# EAGLE design CANTensegrityBoard (EAGLE 6.4)

## Sheet 1 of 6
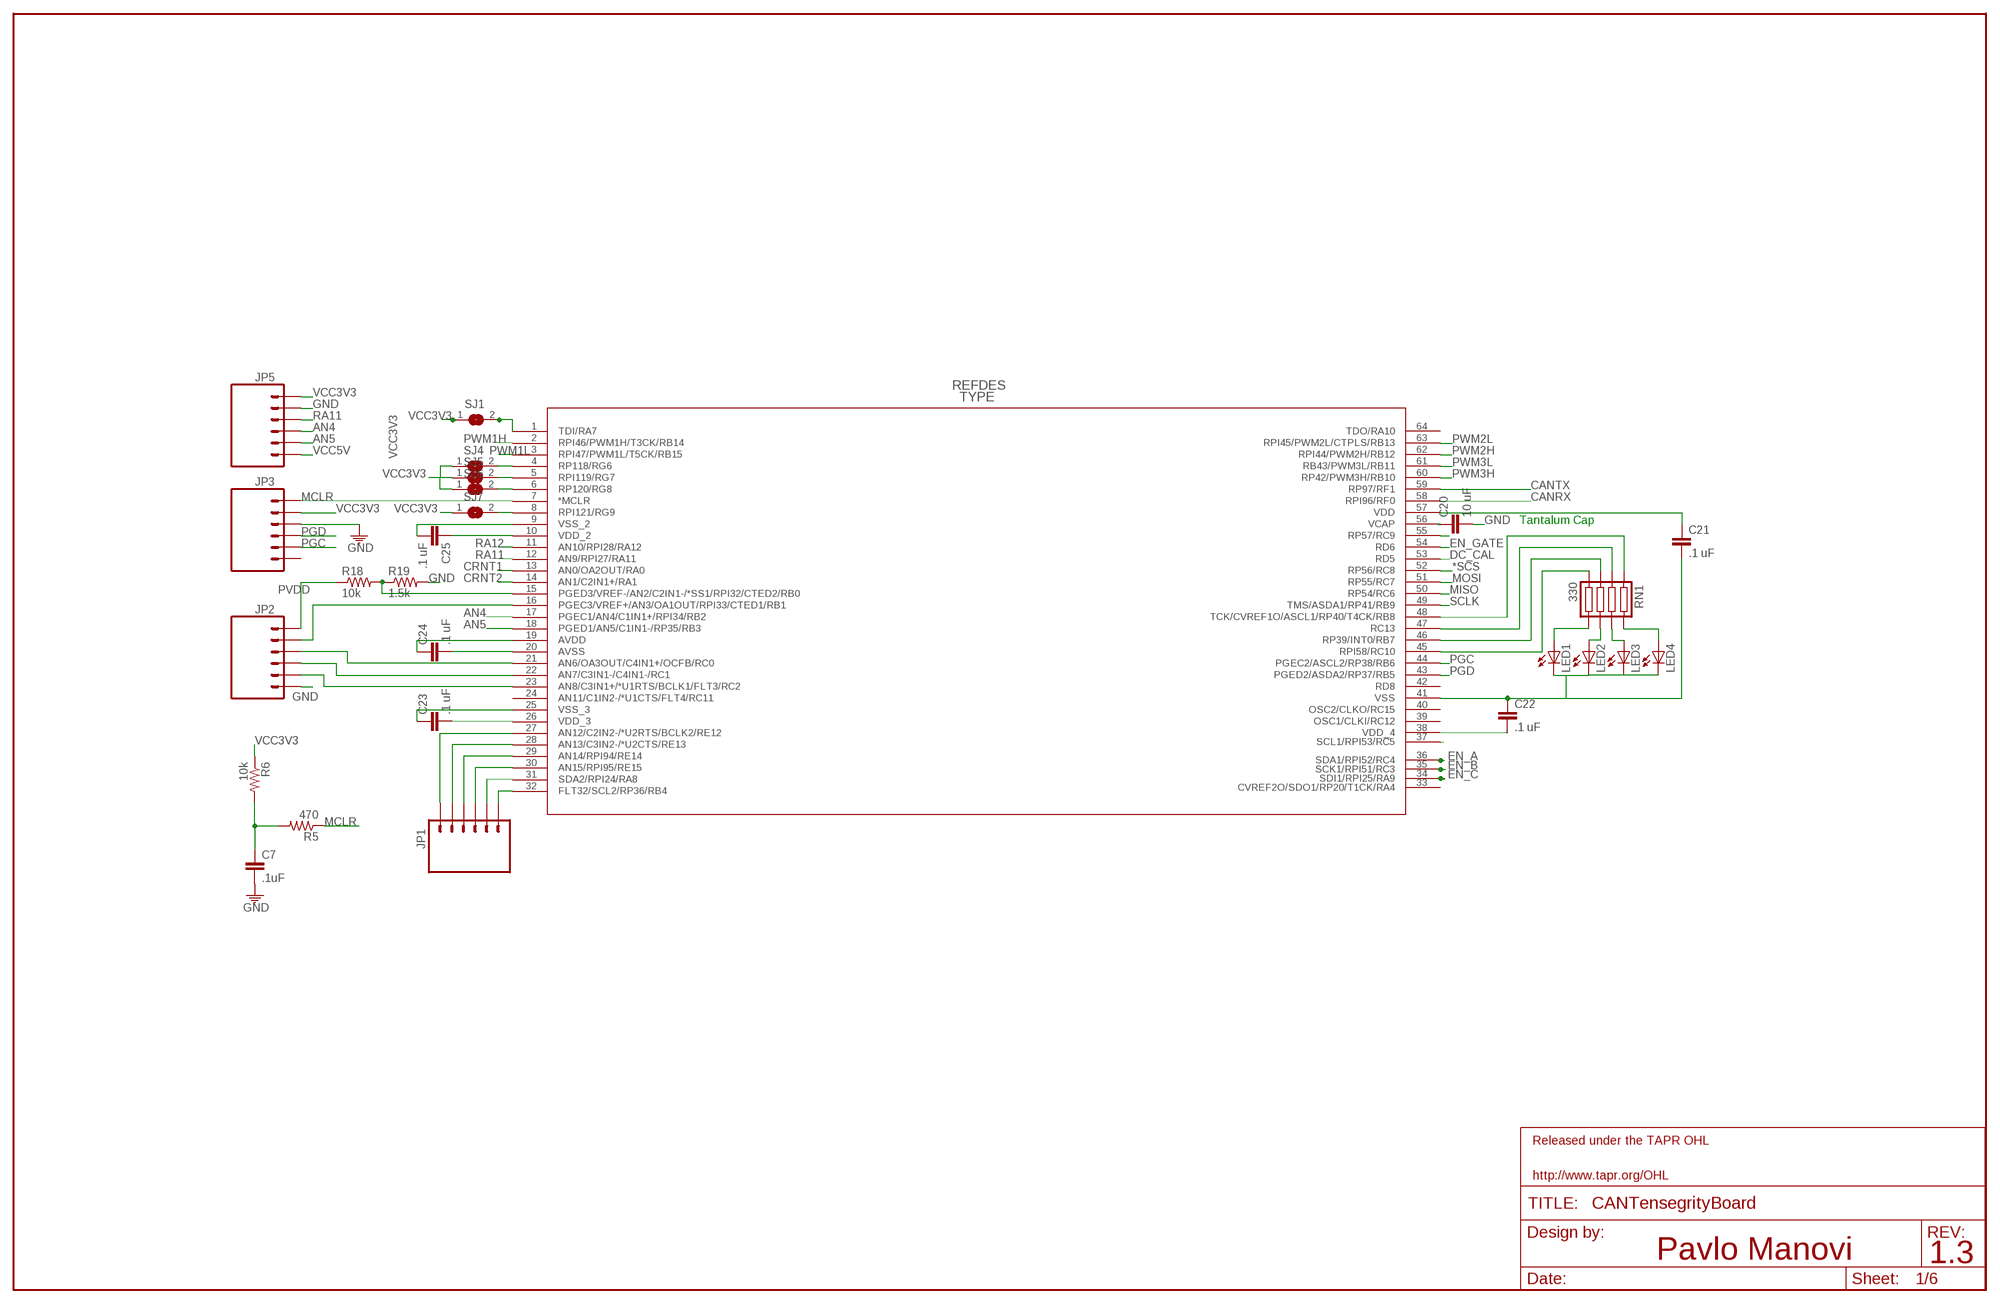
[diagram p0: schematic, sheet 1]

### Parts
C7  .1uF  CAP0805  [0805]
C20  10 uF  CAP1206  [1206]
C21  .1 uF  CAP0805  [0805]
C22  .1 uF  CAP0805  [0805]
C23  .1 uF  CAP0805  [0805]
C24  .1 uF  CAP0805  [0805]
C25  .1 uF  CAP0805  [0805]
JP1  M06SIP  [1X06]
JP2  M06SIP  [1X06]
JP3  M06LOCK  [1X06_LOCK]
JP5  M06LOCK  [1X06_LOCK]
LED1  LED0805  [LED-0805]
LED2  LED0805  [LED-0805]
LED3  LED0805  [LED-0805]
LED4  LED0805  [LED-0805]
R5  470  RESISTOR0805-RES  [0805]
R6  10k  RESISTOR0805-RES  [0805]
R18  10k  RESISTOR0805-RES  [0805]
R19  1.5k  RESISTOR0805-RES  [0805]
RN1  330  RESISTOR_ARRAY-4  [EXB-38V271JV]
SJ1  SJ  [SJ]
SJ4  SJ  [SJ]
SJ5  SJ  [SJ]
SJ6  SJ  [SJ]
SJ7  SJ  [SJ]
U$1  DSPIC33EP128MC502-I/SS  DSPIC33EP256MC50  [QFP64-10X10MC]

### Nets
*SCS [Power]: U$1.52(RP56/RC8) ; also sheet 2
AN4: JP5.4 U$1.17(PGEC1/AN4/C1IN1+/RPI34/RB2)
AN5: JP5.5 U$1.18(PGED1/AN5/C1IN1-/RP35/RB3)
CANRX: U$1.58(RPI96/RF0) ; also sheet 4
CANTX: U$1.59(RP97/RF1) ; also sheet 4
CRNT1: U$1.13(AN0/OA2OUT/RA0) ; also sheet 2
CRNT2: U$1.14(AN1/C2IN1+/RA1) ; also sheet 2
DC_CAL: U$1.53(RD5) ; also sheet 2
EN_A: U$1.36(SDA1/RPI52/RC4) ; also sheet 6
EN_B: U$1.35(SCK1/RPI51/RC3) ; also sheet 6
EN_C: U$1.34(SDI1/RPI25/RA9) ; also sheet 6
EN_GATE: U$1.54(RD6) ; also sheet 2
GND: C7.2 C20.2 C21.2 C22.1 C23.1 C24.2 C25.2 JP2.6 JP3.3 JP5.2 LED1.2(C) LED2.2(C) LED3.2(C) LED4.2(C) R19.2 U$1.9(VSS_2) U$1.20(AVSS) U$1.25(VSS_3) U$1.41(VSS) ; also sheet 3,4,5,6
MCLR: JP3.1 R5.1 U$1.7(*MCLR)
MISO: U$1.50(RP54/RC6) ; also sheet 2
MOSI: U$1.51(RP55/RC7) ; also sheet 2
N$2: C7.1 R5.2 R6.2
N$5: SJ1.2 U$1.1(TDI/RA7)
N$25: R18.2 R19.1 U$1.15(PGED3/VREF-/AN2/C2IN1-/*SS1/RPI32/CTED2/RB0)
N$26: U$1.37(SCL1/RPI53/RC5)
N$27: SJ4.2 U$1.4(RP118/RG6)
N$28: SJ5.2 U$1.5(RPI119/RG7)
N$29: SJ6.2 U$1.6(RP120/RG8)
N$30: SJ7.2 U$1.8(RPI121/RG9)
N$31: C20.1 U$1.56(VCAP)
N$33: RN1.P$1 U$1.48(TCK/CVREF1O/ASCL1/RP40/T4CK/RB8)
N$41: RN1.P$2 U$1.47(RC13)
N$42: RN1.P$3 U$1.46(RP39/INT0/RB7)
N$43: RN1.P$4 U$1.45(RPI58/RC10)
N$44: LED1.1(A) RN1.P$5
N$45: LED2.1(A) RN1.P$6
N$46: LED3.1(A) RN1.P$7
N$47: LED4.1(A) RN1.P$8
N$48: JP1.6 U$1.32(FLT32/SCL2/RP36/RB4)
N$49: JP1.5 U$1.31(SDA2/RPI24/RA8)
N$50: JP1.4 U$1.30(AN15/RPI95/RE15)
N$51: JP1.3 U$1.29(AN14/RPI94/RE14)
N$52: JP1.2 U$1.28(AN13/C3IN2-/*U2CTS/RE13)
N$53: JP1.1 U$1.27(AN12/C2IN2-/*U2RTS/BCLK2/RE12)
N$55: JP2.2 U$1.16(PGEC3/VREF+/AN3/OA1OUT/RPI33/CTED1/RB1)
N$56: JP2.3 U$1.21(AN6/OA3OUT/C4IN1+/OCFB/RC0)
N$57: JP2.4 U$1.22(AN7/C3IN1-/C4IN1-/RC1)
N$58: JP2.5 U$1.23(AN8/C3IN1+/*U1RTS/BCLK1/FLT3/RC2)
PGC: JP3.5 U$1.44(PGEC2/ASCL2/RP38/RB6)
PGD [small]: JP3.4 U$1.43(PGED2/ASDA2/RP37/RB5)
PVDD [Power]: JP2.1 R18.1 ; also sheet 2,3
PWM1H: U$1.2(RPI46/PWM1H/T3CK/RB14) ; also sheet 2
PWM1L: U$1.3(RPI47/PWM1L/T5CK/RB15) ; also sheet 2
PWM2H: U$1.62(RPI44/PWM2H/RB12) ; also sheet 2
PWM2L: U$1.63(RPI45/PWM2L/CTPLS/RB13) ; also sheet 2
PWM3H: U$1.60(RP42/PWM3H/RB10) ; also sheet 2
PWM3L: U$1.61(RB43/PWM3L/RB11) ; also sheet 2
RA11: JP5.3 U$1.12(AN9/RPI27/RA11)
RA12: U$1.11(AN10/RPI28/RA12)
RC9: U$1.55(RP57/RC9)
SCLK: U$1.49(TMS/ASDA1/RP41/RB9) ; also sheet 2
VCC3V3 [Power]: C21.1 C22.2 C23.2 C24.1 C25.1 JP3.2 JP5.1 R6.1 SJ1.1 SJ4.1 SJ5.1 SJ6.1 SJ7.1 U$1.10(VDD_2) U$1.19(AVDD) U$1.26(VDD_3) U$1.38(VDD_4) U$1.57(VDD) ; also sheet 2,4,5,6
VCC5V: JP5.6 ; also sheet 5
Unconnected: JP3.6 U$1.24(AN11/C1IN2-/*U1CTS/FLT4/RC11) U$1.33(CVREF2O/SDO1/RP20/T1CK/RA4) U$1.39(OSC1/CLKI/RC12) U$1.40(OSC2/CLKO/RC15) U$1.42(RD8) U$1.64(TDO/RA10)

### Notes on the sheet
- Tantalum Cap

## Sheet 2 of 6
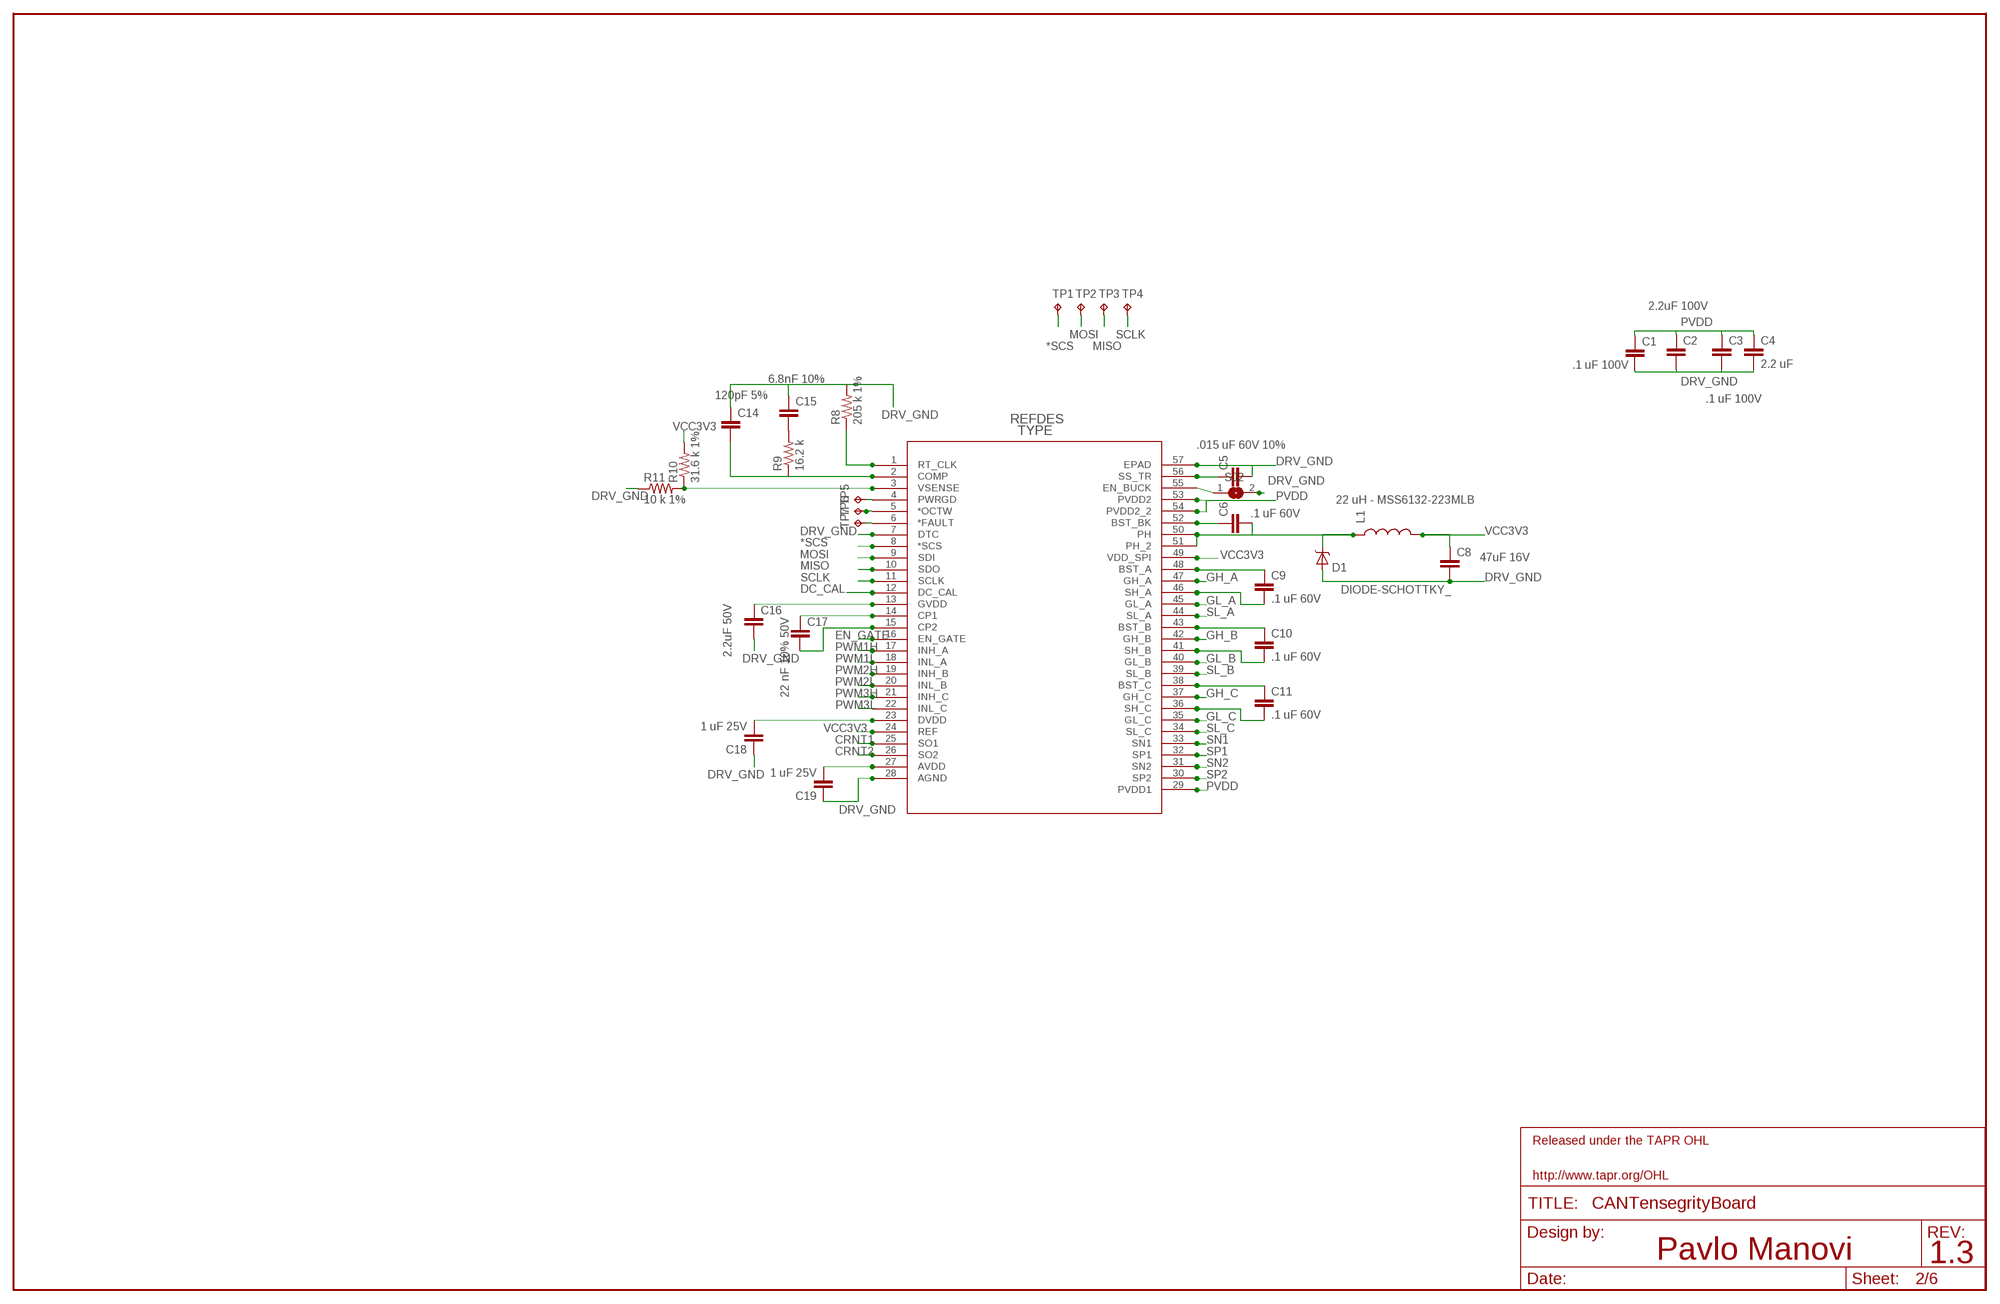
[diagram p1: schematic, sheet 2]

### Parts
C1  .1 uF 100V  CAP0805  [0805]
C2  2.2uF 100V  CAP1206  [1206]
C3  .1 uF 100V  CAP0805  [0805]
C4  2.2 uF  CAP1206  [1206]
C5  .015 uF 60V 10%  CAP0805  [0805]
C6  .1 uF 60V  CAP0805  [0805]
C8  47uF 16V  CAP1206  [1206]
C9  .1 uF 60V  CAP0805  [0805]
C10  .1 uF 60V  CAP0805  [0805]
C11  .1 uF 60V  CAP0805  [0805]
C14  120pF 5%  CAP0805  [0805]
C15  6.8nF 10%  CAP0805  [0805]
C16  2.2uF 50V  CAP1206  [1206]
C17  22 nF 10% 50V  CAP0805  [0805]
C18  1 uF 25V  CAP0805  [0805]
C19  1 uF 25V  CAP0805  [0805]
D1  DIODE-SCHOTTKY_  [SMA-DIODE]
L1  22 uH - MSS6132-223MLB  INDUCTOR  [MSS6132]
R8  205 k 1%  RESISTOR0805-RES  [0805]
R9  16.2 k  RESISTOR0805-RES  [0805]
R10  31.6 k 1%  RESISTOR0805-RES  [0805]
R11  10 k 1%  RESISTOR0805-RES  [0805]
SJ2  SJ  [SJ]
TP1  TPTP06R  [TP06R]
TP2  TPTP06R  [TP06R]
TP3  TPTP06R  [TP06R]
TP4  TPTP06R  [TP06R]
TP5  TPTP06R  [TP06R]
TP6  TPTP06R  [TP06R]
TP7  TPTP06R  [TP06R]
U$2  DRV8301  [DCA56_6P35X3P61]

### Nets
*SCS [Power]: TP1.TP U$2.8(*SCS) ; also sheet 1
CRNT1: U$2.25(SO1) ; also sheet 1
CRNT2: U$2.26(SO2) ; also sheet 1
DC_CAL: U$2.12(DC_CAL) ; also sheet 1
DRV_GND [Power]: C1.2 C2.2 C3.2 C4.2 C5.2 C8.2 C14.1 C15.1 C16.2 C18.1 C19.1 D1.A R8.2 R11.1 SJ2.2 U$2.7(DTC) U$2.28(AGND) U$2.57(EPAD) ; also sheet 3
EN_GATE: U$2.16(EN_GATE) ; also sheet 1
GH_A: U$2.47(GH_A) ; also sheet 3
GH_B: U$2.42(GH_B) ; also sheet 3
GH_C: U$2.37(GH_C) ; also sheet 3
GL_A: U$2.45(GL_A) ; also sheet 3
GL_B: U$2.40(GL_B) ; also sheet 3
GL_C: U$2.35(GL_C) ; also sheet 3
MISO: TP3.TP U$2.10(SDO) ; also sheet 1
MOSI: TP2.TP U$2.9(SDI) ; also sheet 1
N$1: C5.1 U$2.56(SS_TR)
N$4: C6.1 U$2.52(BST_BK)
N$7: TP5.TP U$2.4(PWRGD)
N$8: C9.1 U$2.48(BST_A)
N$9: C10.1 U$2.43(BST_B)
N$10: C11.1 U$2.38(BST_C)
N$11: SJ2.1 U$2.55(EN_BUCK)
N$12: TP6.TP U$2.5(*OCTW)
N$14: R8.1 U$2.1(RT_CLK)
N$15: C15.2 R9.2
N$16: C14.2 R9.1 U$2.2(COMP)
N$17: R10.1 R11.2 U$2.3(VSENSE)
N$18: C16.1 U$2.13(GVDD)
N$19: C17.1 U$2.14(CP1)
N$20: C17.2 U$2.15(CP2)
N$21: C18.2 U$2.23(DVDD)
N$22: C19.2 U$2.27(AVDD)
N$24: TP7.TP U$2.6(*FAULT)
PH1: C6.2 D1.C L1.P$1 U$2.50(PH) U$2.51(PH_2)
PVDD [Power]: C1.1 C2.1 C3.1 C4.1 U$2.29(PVDD1) U$2.53(PVDD2) U$2.54(PVDD2_2) ; also sheet 1,3
PWM1H: U$2.17(INH_A) ; also sheet 1
PWM1L: U$2.18(INL_A) ; also sheet 1
PWM2H: U$2.19(INH_B) ; also sheet 1
PWM2L: U$2.20(INL_B) ; also sheet 1
PWM3H: U$2.21(INH_C) ; also sheet 1
PWM3L: U$2.22(INL_C) ; also sheet 1
SCLK: TP4.TP U$2.11(SCLK) ; also sheet 1
SH_A: C9.2 U$2.46(SH_A) ; also sheet 3
SH_B: C10.2 U$2.41(SH_B) ; also sheet 3
SH_C: C11.2 U$2.36(SH_C) ; also sheet 3
SL_A: U$2.44(SL_A) ; also sheet 3
SL_B [Power]: U$2.39(SL_B) ; also sheet 3
SL_C: U$2.34(SL_C) ; also sheet 3
SN1: U$2.33(SN1) ; also sheet 3
SN2: U$2.31(SN2) ; also sheet 3
SP1 [Power]: U$2.32(SP1) ; also sheet 3
SP2 [Power]: U$2.30(SP2) ; also sheet 3
VCC3V3 [Power]: C8.1 L1.P$2 R10.2 U$2.24(REF) U$2.49(VDD_SPI) ; also sheet 1,4,5,6

## Sheet 3 of 6
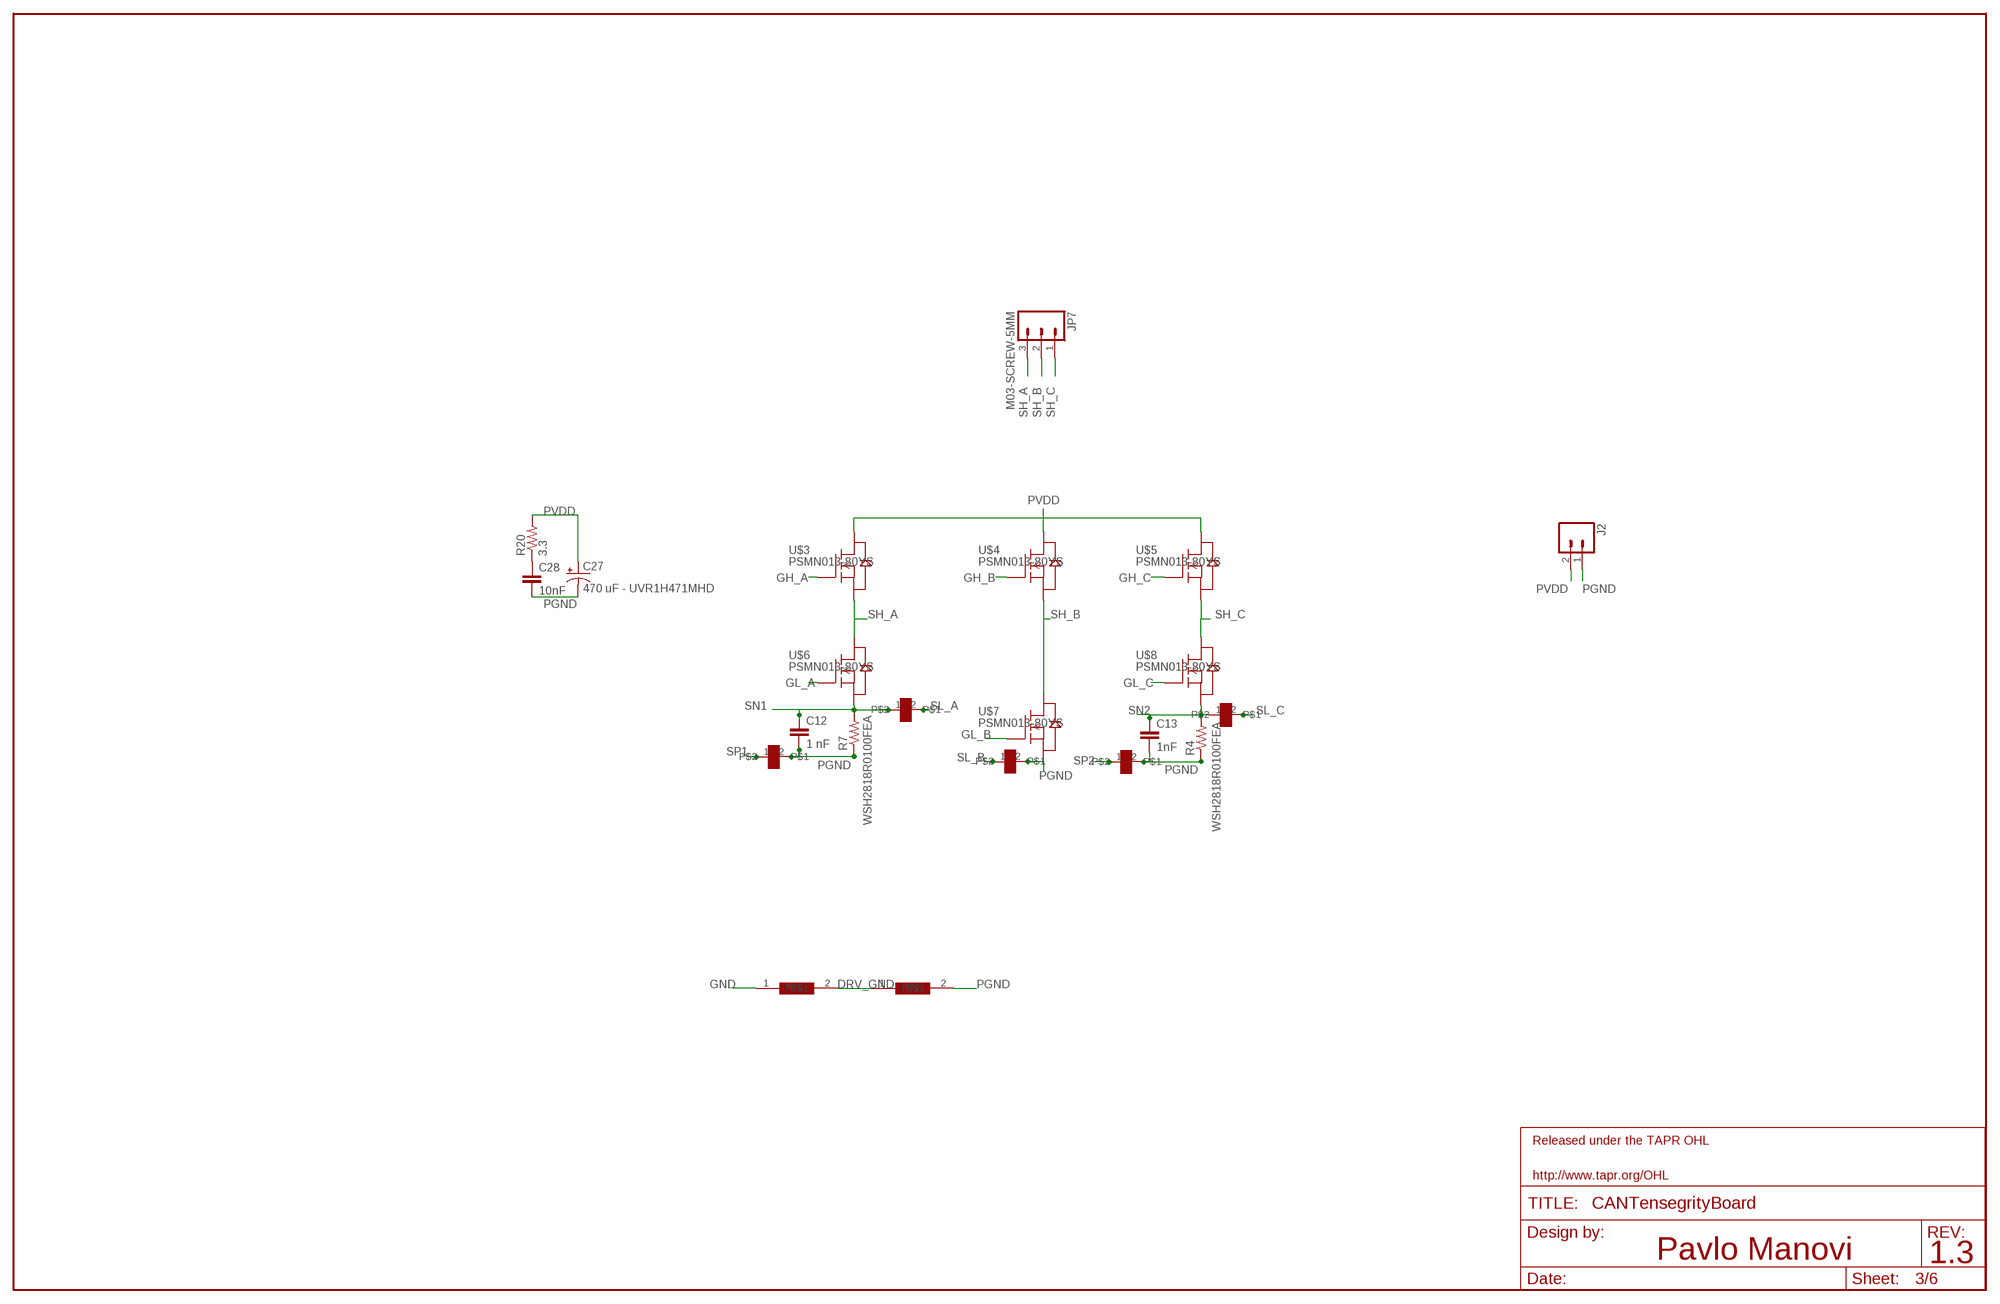
[diagram p2: schematic, sheet 3]

### Parts
C12  1 nF  CAP0805  [0805]
C13  1nF  CAP0805  [0805]
C27  470 uF - UVR1H471MHD  CAP_POLPTH4  [CPOL-RADIAL-1000UF-25V]
C28  10nF  CAP0805  [0805]
J2  M02PTH4  [1X02_XTRA_BIG]
JP7  M03-SCREW-5MM  [SCREWTERMINAL-5MM-3]
R4  WSH2818R0100FEA  RESISTOR  [SMT-REF]
R7  WSH2818R0100FEA  RESISTOR  [SMT-REF]
R20  3.3  RESISTOR0805-RES  [0805]
U9  H1206T500R-10  [1206]
U10  H1206T500R-10  [1206]
U11  MH1608-600Y  [0603]
U12  MH1608-600Y  [0603]
U13  MH1608-600Y  [0603]
U14  MH1608-600Y  [0603]
U15  MH1608-600Y  [0603]
U$3  PSMN013-80YS  [TO127P600X120-5N]
U$4  PSMN013-80YS  [TO127P600X120-5N]
U$5  PSMN013-80YS  [TO127P600X120-5N]
U$6  PSMN013-80YS  [TO127P600X120-5N]
U$7  PSMN013-80YS  [TO127P600X120-5N]
U$8  PSMN013-80YS  [TO127P600X120-5N]

### Nets
DRV_GND [Power]: U9.2 U10.1 ; also sheet 2
GH_A: U$3.4(G) ; also sheet 2
GH_B: U$4.4(G) ; also sheet 2
GH_C: U$5.4(G) ; also sheet 2
GL_A: U$6.4(G) ; also sheet 2
GL_B: U$7.4(G) ; also sheet 2
GL_C: U$8.4(G) ; also sheet 2
GND: U9.1 ; also sheet 1,4,5,6
N$6: C28.1 R20.1
PGND [Power]: C12.2 C13.2 C27.2(-) C28.2 J2.1 R4.1 R7.1 U10.2 U11.2 U13.2 U14.2 U$7.1(S) U$7.2(S) U$7.3(S)
PVDD [Power]: C27.1(+) J2.2 R20.2 U$3.5(D) U$3.P$1(D) U$3.P$2(D) U$3.P$3(D) U$3.P$4(D) U$3.P$5(D) U$3.P$6(D) U$3.P$7(D) U$3.P$8(D) U$3.P$9(D) U$4.5(D) U$4.P$1(D) U$4.P$2(D) U$4.P$3(D) U$4.P$4(D) U$4.P$5(D) U$4.P$6(D) U$4.P$7(D) U$4.P$8(D) U$4.P$9(D) U$5.5(D) U$5.P$1(D) U$5.P$2(D) U$5.P$3(D) U$5.P$4(D) U$5.P$5(D) U$5.P$6(D) U$5.P$7(D) U$5.P$8(D) U$5.P$9(D) ; also sheet 1,2
SH_A: JP7.3 U$3.1(S) U$3.2(S) U$3.3(S) U$6.5(D) U$6.P$1(D) U$6.P$2(D) U$6.P$3(D) U$6.P$4(D) U$6.P$5(D) U$6.P$6(D) U$6.P$7(D) U$6.P$8(D) U$6.P$9(D) ; also sheet 2
SH_B: JP7.2 U$4.1(S) U$4.2(S) U$4.3(S) U$7.5(D) U$7.P$1(D) U$7.P$2(D) U$7.P$3(D) U$7.P$4(D) U$7.P$5(D) U$7.P$6(D) U$7.P$7(D) U$7.P$8(D) U$7.P$9(D) ; also sheet 2
SH_C: JP7.1 U$5.1(S) U$5.2(S) U$5.3(S) U$8.5(D) U$8.P$1(D) U$8.P$2(D) U$8.P$3(D) U$8.P$4(D) U$8.P$5(D) U$8.P$6(D) U$8.P$7(D) U$8.P$8(D) U$8.P$9(D) ; also sheet 2
SL_A: U12.2 ; also sheet 2
SL_B [Power]: U11.1 ; also sheet 2
SL_C: U15.2 ; also sheet 2
SN1: C12.1 R7.2 U12.1 U$6.1(S) U$6.2(S) U$6.3(S) ; also sheet 2
SN2: C13.1 R4.2 U15.1 U$8.1(S) U$8.2(S) U$8.3(S) ; also sheet 2
SP1 [Power]: U13.1 ; also sheet 2
SP2 [Power]: U14.1 ; also sheet 2

## Sheet 4 of 6
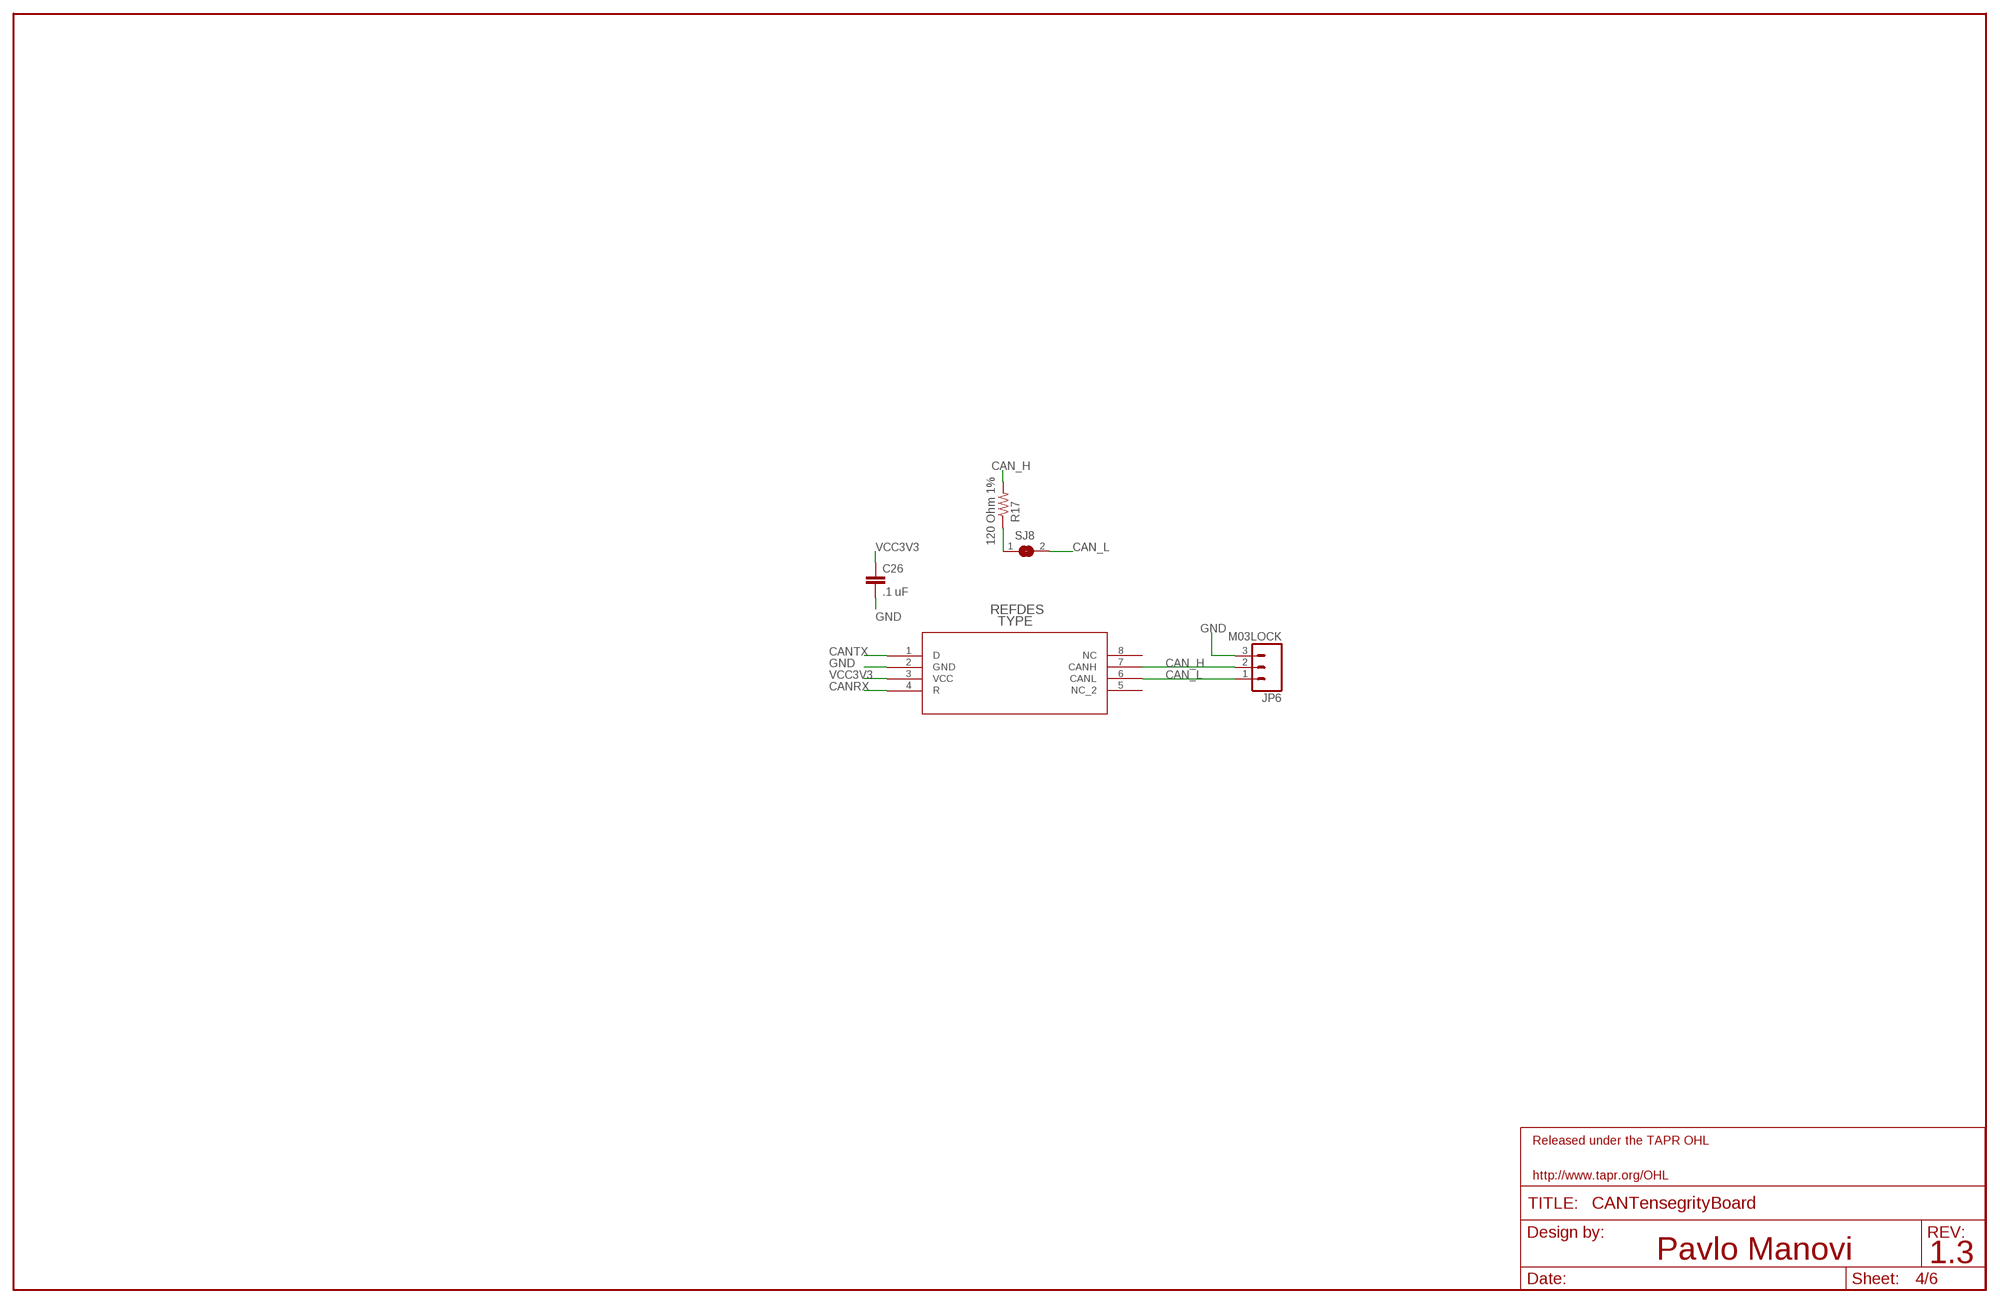
[diagram p3: schematic, sheet 4]

### Parts
C26  .1 uF  CAP0805  [0805]
JP6  M03LOCK  [1X03_LOCK]
R17  120 Ohm 1%  RESISTOR0805-RES  [0805]
SJ8  SJ  [SJ]
U2  SN65HVD232_D_8  [D8]

### Nets
CAN_H: JP6.2 R17.2 U2.7(CANH)
CAN_L: JP6.1 SJ8.2 U2.6(CANL)
CANRX: U2.4(R) ; also sheet 1
CANTX: U2.1(D) ; also sheet 1
GND: C26.2 JP6.3 U2.2(GND) ; also sheet 1,3,5,6
N$64: R17.1 SJ8.1
VCC3V3 [Power]: C26.1 U2.3(VCC) ; also sheet 1,2,5,6
Unconnected: U2.5(NC_2) U2.8(NC)

## Sheet 5 of 6
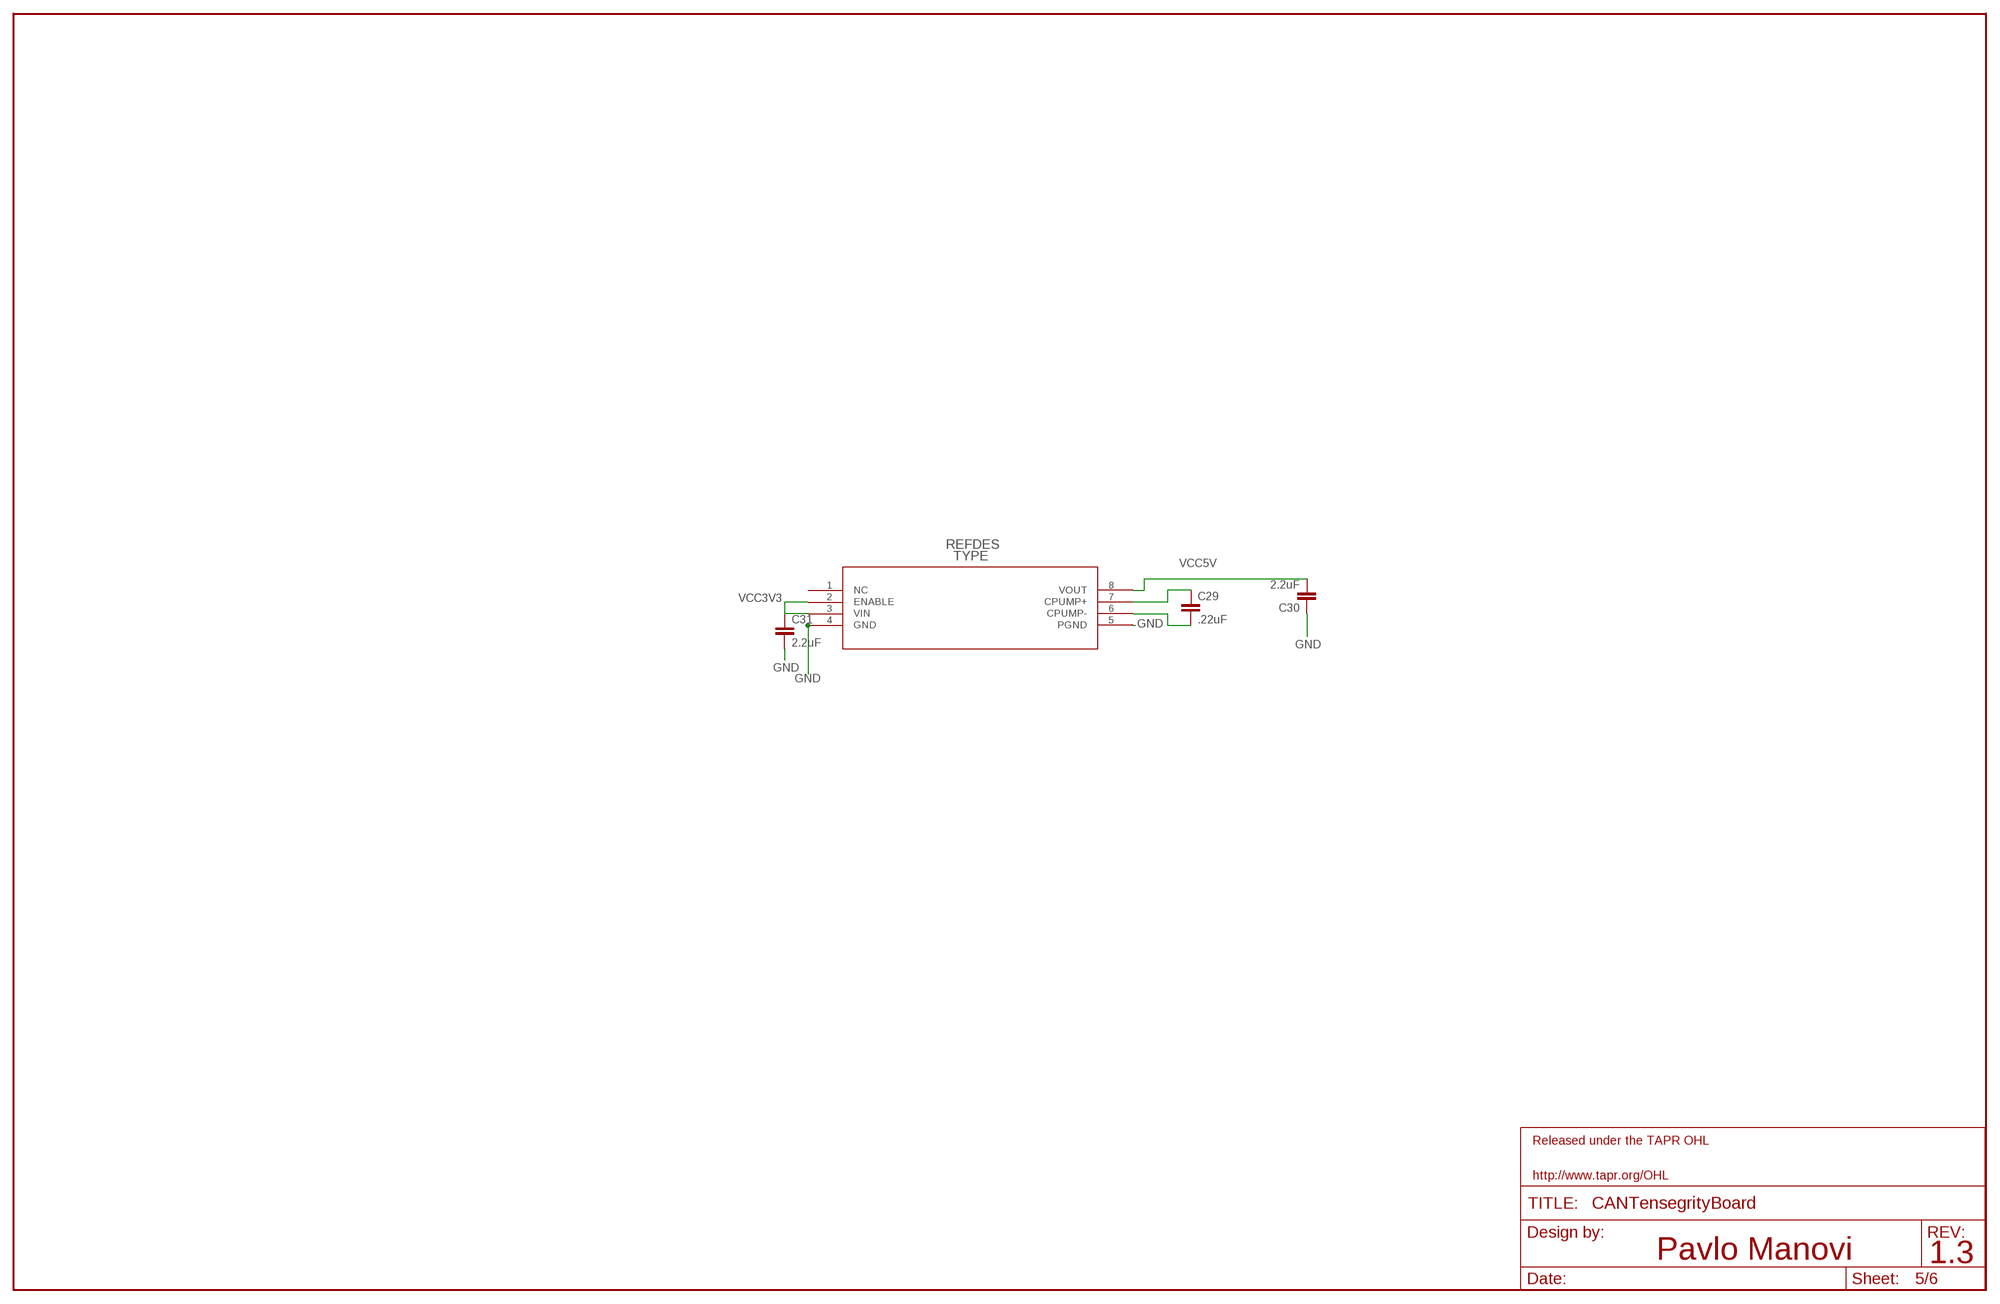
[diagram p4: schematic, sheet 5]

### Parts
C29  .22uF  CAP0805  [0805]
C30  2.2uF  CAP0805  [0805]
C31  2.2uF  CAP0805  [0805]
U1  REG711-5_DGK_8  [DGK8]

### Nets
GND: C30.1 C31.2 U1.4(GND) U1.5(PGND) ; also sheet 1,3,4,6
N$13: C29.2 U1.6(CPUMP-)
N$23: C29.1 U1.7(CPUMP+)
VCC3V3 [Power]: C31.1 U1.2(ENABLE) U1.3(VIN) ; also sheet 1,2,4,6
VCC5V: C30.2 U1.8(VOUT) ; also sheet 1
Unconnected: U1.1(NC)

## Sheet 6 of 6
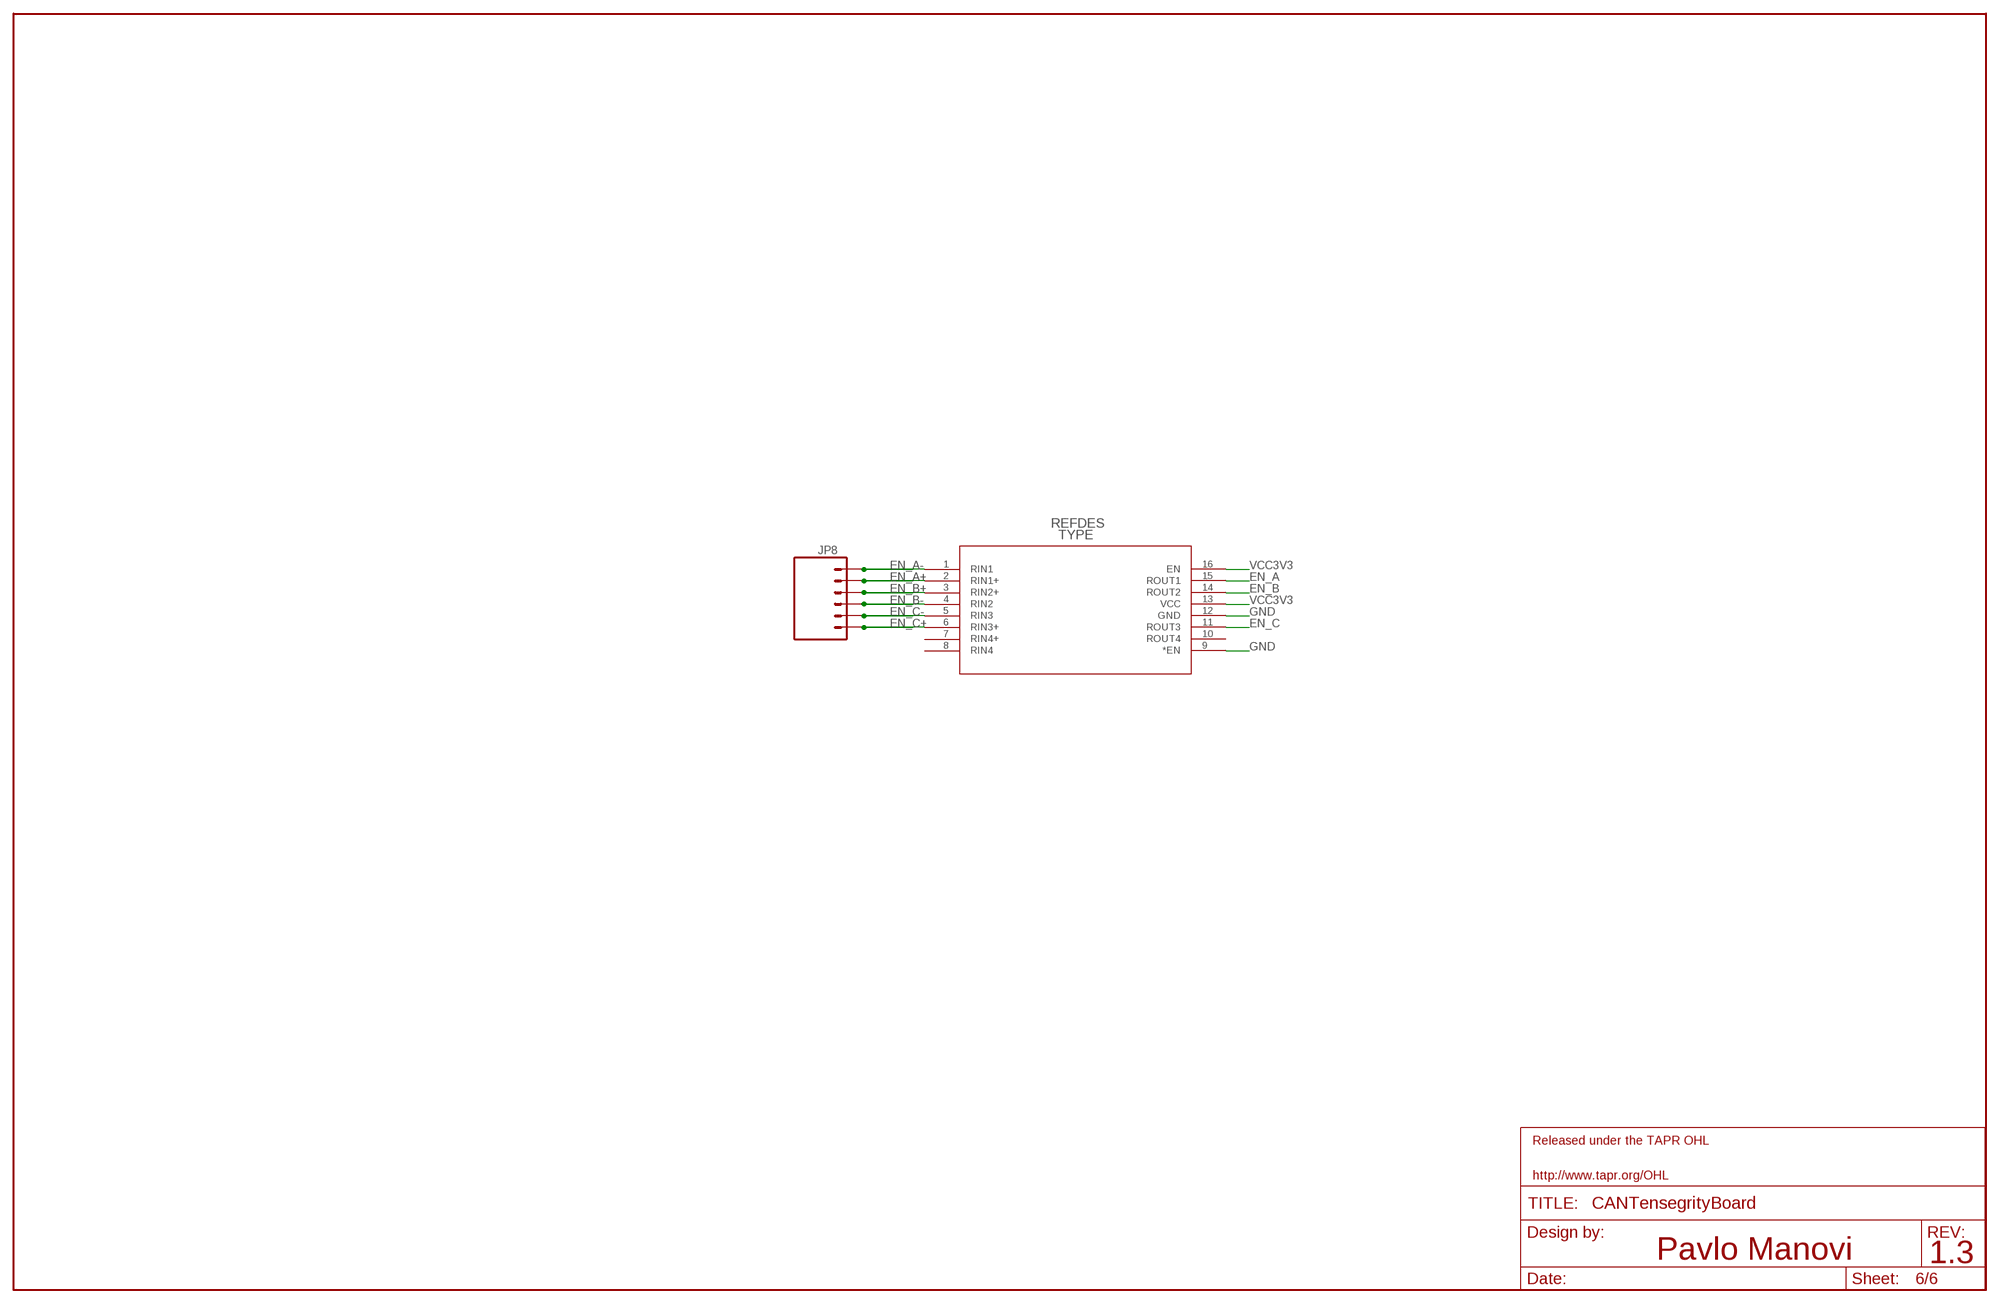
[diagram p5: schematic, sheet 6]

### Parts
JP8  M06SIP_LOCK  [1X06-SIP_LOCK]
U3  SN65LVDT348_PW_1  [PW16]

### Nets
EN_A: U3.15(ROUT1) ; also sheet 1
EN_A+: JP8.2 U3.2(RIN1+)
EN_A-: JP8.1 U3.1(RIN1)
EN_B: U3.14(ROUT2) ; also sheet 1
EN_B+: JP8.3 U3.3(RIN2+)
EN_B-: JP8.4 U3.4(RIN2)
EN_C: U3.11(ROUT3) ; also sheet 1
EN_C+: JP8.6 U3.6(RIN3+)
EN_C-: JP8.5 U3.5(RIN3)
GND: U3.9(*EN) U3.12(GND) ; also sheet 1,3,4,5
VCC3V3 [Power]: U3.13(VCC) U3.16(EN) ; also sheet 1,2,4,5
Unconnected: U3.7(RIN4+) U3.8(RIN4) U3.10(ROUT4)

## Library data of the parts
C1-C26 C28-C31 = ASL:CAP: Capacitor Standard 0603 ceramic capacitor, and 0.1" leaded capacitor.
C27 = ASL:CAP_POL: Capacitor Polarized These are standard SMD and PTH capacitors. Normally 10uF, 47uF, and 100uF in electrolytic and tantalum varieties. Always verify the external diameter of the through hole cap, it varies with capacity, voltage, and manufacturer. The EIA devices should be standard.
D1 = ASL:DIODE-SCHOTTKY
J2 = ASL:M02: Header 2 Standard 2-pin 0.1" header. Use with straight break away headers (SKU : PRT-00116), right angle break away headers (PRT-00553), swiss pins (PRT-00743), machine pins (PRT-00117), and female headers (PRT-00115). Molex polarized connector foot print use with SKU : PRT-08233 with associated crimp pins and housings.
JP1 JP2 JP8 = ASL:M06: Header 6 Standard 6-pin 0.1" header. Use with straight break away headers (SKU : PRT-00116), right angle break away headers (PRT-00553), swiss pins (PRT-00743), machine pins (PRT-00117), and female headers (PRT-00115). Molex polarized connector foot print use with SKU : PRT-08094 with associated crimp pins and housings. NOTES ON THE VARIANTS LOCK and LOCK_LONGPADS... This footprint was designed to help hold the alignment of a through-hole component (i.e. 6-pin header) while soldering it into place. You may notice that each hole has been shifted either up or down by 0.005 of an inch from it's more standard position (which is a perfectly straight line). This slight alteration caused the pins (the squares in the middle) to touch the edges of the holes. Because they are alternating, it causes a "brace" to hold the component in place. 0.005 has proven to be the perfect amount of "off-center" position when using our standard breakaway headers. Although looks a little odd when you look at the bare footprint, once you have a header in there, the alteration is very hard to notice. Also, if you push a header all the way into place, it is covered up entirely on the bottom side. This idea of altering the position of holes to aid alignment will be further integrated into the Sparkfun Library for other footprints. It can help hold any component with 3 or more connection pins.
JP3 JP5 = CMPE118lib:M06: Header 6 Standard 6-pin 0.1" header. Use with straight break away headers (SKU : PRT-00116), right angle break away headers (PRT-00553), swiss pins (PRT-00743), machine pins (PRT-00117), and female headers (PRT-00115). Molex polarized connector foot print use with SKU : PRT-08094 with associated crimp pins and housings. NOTES ON THE VARIANTS LOCK and LOCK_LONGPADS... This footprint was designed to help hold the alignment of a through-hole component (i.e. 6-pin header) while soldering it into place. You may notice that each hole has been shifted either up or down by 0.005 of an inch from it's more standard position (which is a perfectly straight line). This slight alteration caused the pins (the squares in the middle) to touch the edges of the holes. Because they are alternating, it causes a "brace" to hold the component in place. 0.005 has proven to be the perfect amount of "off-center" position when using our standard breakaway headers. Although looks a little odd when you look at the bare footprint, once you have a header in there, the alteration is very hard to notice. Also, if you push a header all the way into place, it is covered up entirely on the bottom side. This idea of altering the position of holes to aid alignment will be further integrated into the Sparkfun Library for other footprints. It can help hold any component with 3 or more connection pins.
JP6 = ASL:M03: Header 3 Standard 3-pin 0.1" header. Use with straight break away headers (SKU : PRT-00116), right angle break away headers (PRT-00553), swiss pins (PRT-00743), machine pins (PRT-00117), and female headers (PRT-00115). Molex polarized connector foot print use with SKU : PRT-08232 with associated crimp pins and housings.
JP7 = pavlo:M03: Header 3 Standard 3-pin 0.1" header. Use with straight break away headers (SKU : PRT-00116), right angle break away headers (PRT-00553), swiss pins (PRT-00743), machine pins (PRT-00117), and female headers (PRT-00115). Molex polarized connector foot print use with SKU : PRT-08232 with associated crimp pins and housings.
L1 = pavlo:INDUCTOR: Inductors Basic Inductor/Choke - 0603 and 1206. Footprints are not proven and vary greatly between part numbers.
LED1-LED4 = ASL:LED: LEDs Standard schematic elements and footprints for 5mm, 3mm, 1206, and 0603 sized LEDs. 5mm - Spark Fun Electronics SKU : COM-00529 (and others)
R4 R7 = pavlo:RESISTOR: Resistor Basic schematic elements and footprints for 0603, 1206, and PTH resistors.
R5 R6 = CMPE118lib:RESISTOR: Resistor Basic schematic elements and footprints for 0603, 1206, and PTH resistors.
R8-R11 R17-R20 = ASL:RESISTOR: Resistor Basic schematic elements and footprints for 0603, 1206, and PTH resistors.
RN1 = ASL:RESISTOR_ARRAY-4: Chip Resistor Array 4 Single Resistor Source: http://industrial.panasonic.com/www-data/pdf/AOC0000/AOC0000PE2.pdf; OC_FARNELL: unknown; OC_NEWARK: unknown
SJ1 SJ2 SJ4-SJ8 = jumper:SJ: SMD solder JUMPER
TP1-TP7 = testpad:TP: Test pad
U1 = pavlo:REG711-5_DGK_8
U2 = pavlo:SN65HVD232_D_8
U3 = pavlo:SN65LVDT348_PW_1
U9 U10 = pavlo:H1206T500R-10
U11-U15 = pavlo:MH1608-600Y
U$1 = pavlo:DSPIC33EP256MC50
U$2 = pavlo:DRV8301
U$3-U$8 = pavlo:PSMN013-80YS

## Net classes
2 small: width 0.254 mm, clearance 0.254 mm to class 1
3 Power: clearance 0.381 mm to class 0

## Board
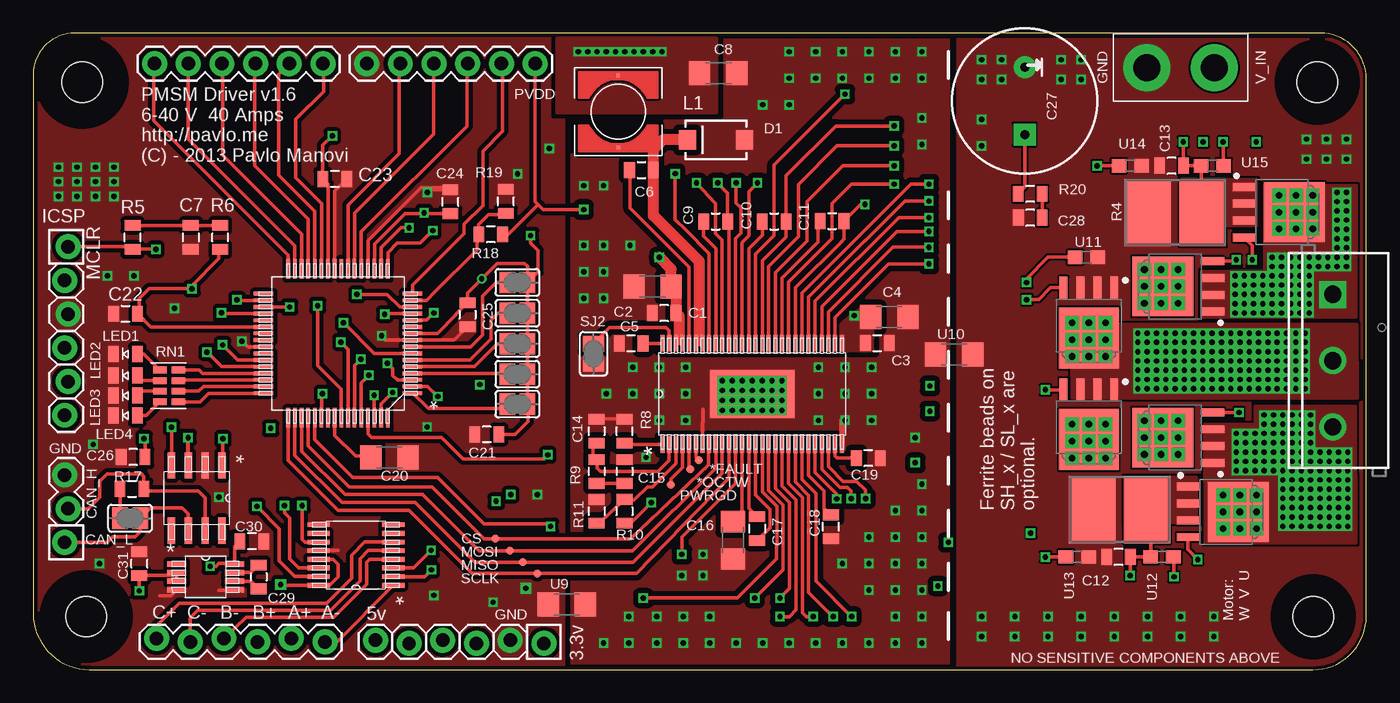
[diagram p6: board, top side]
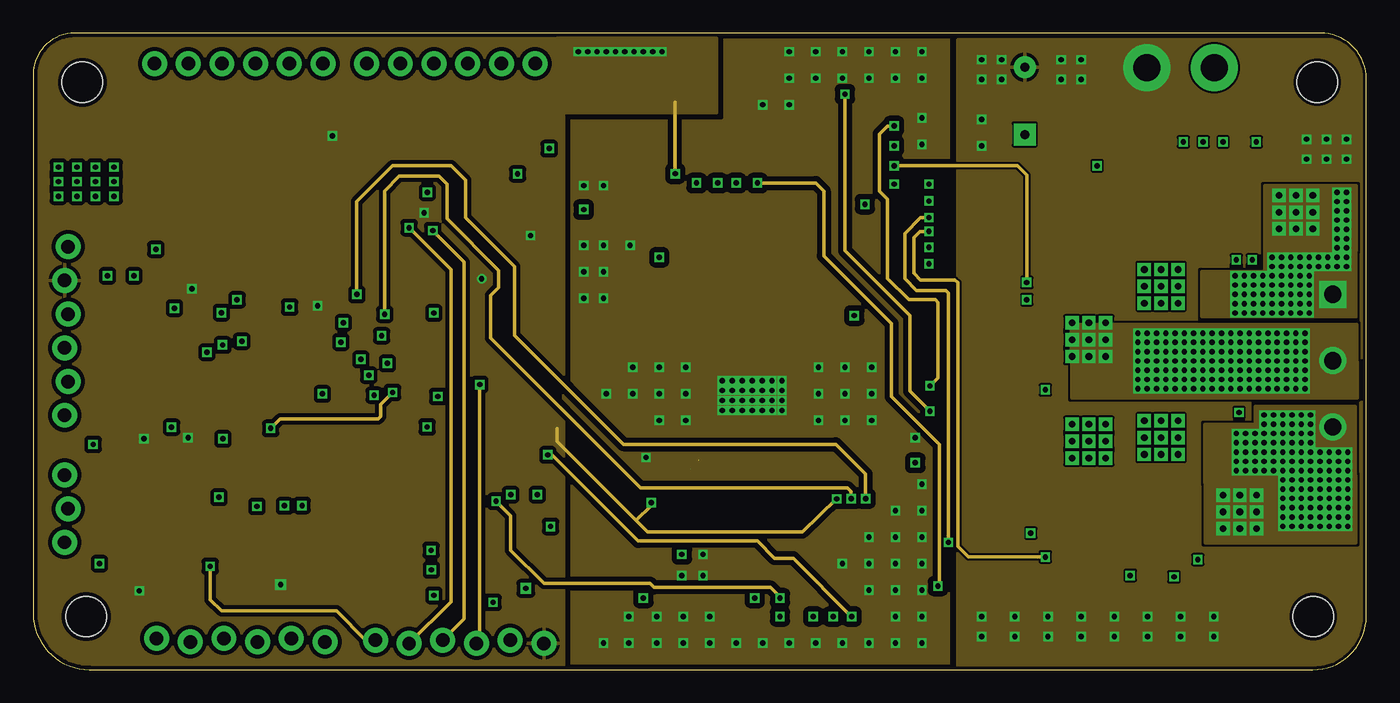
[diagram p7: board, inner layer Route2]
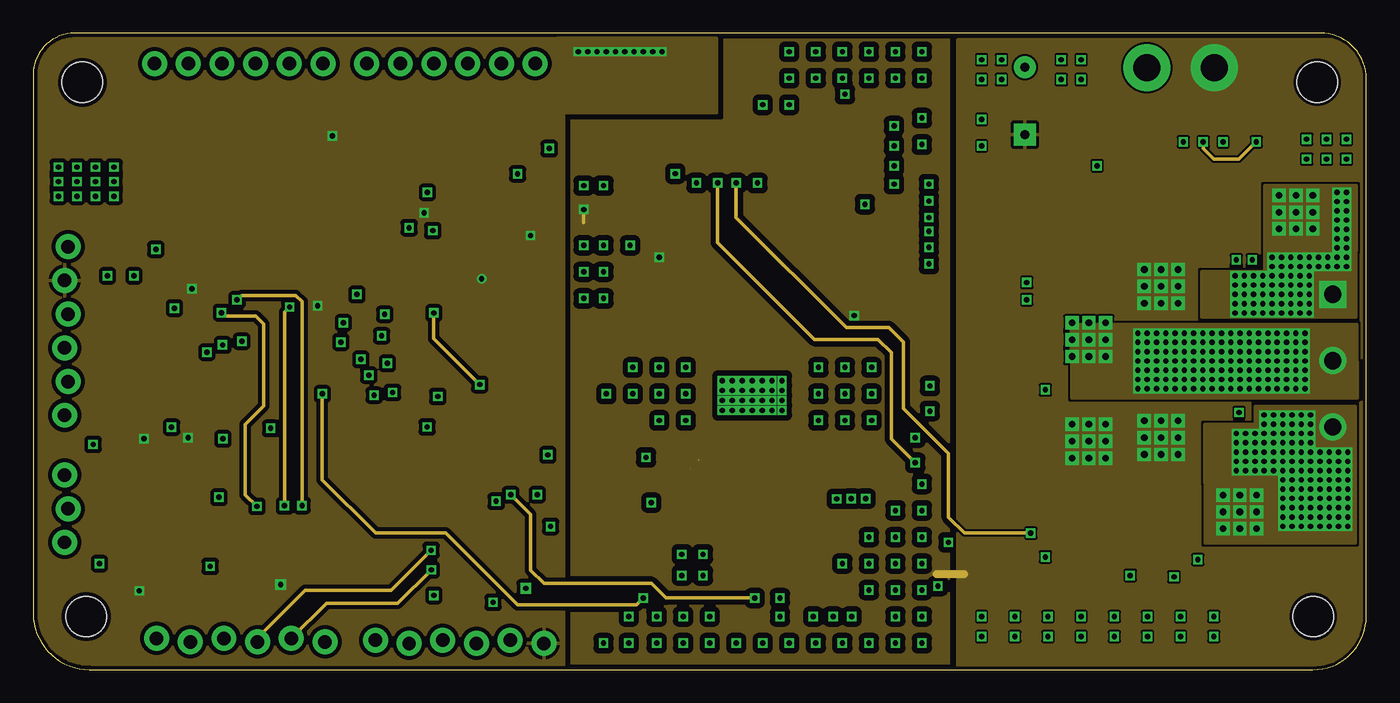
[diagram p8: board, inner layer Route15]
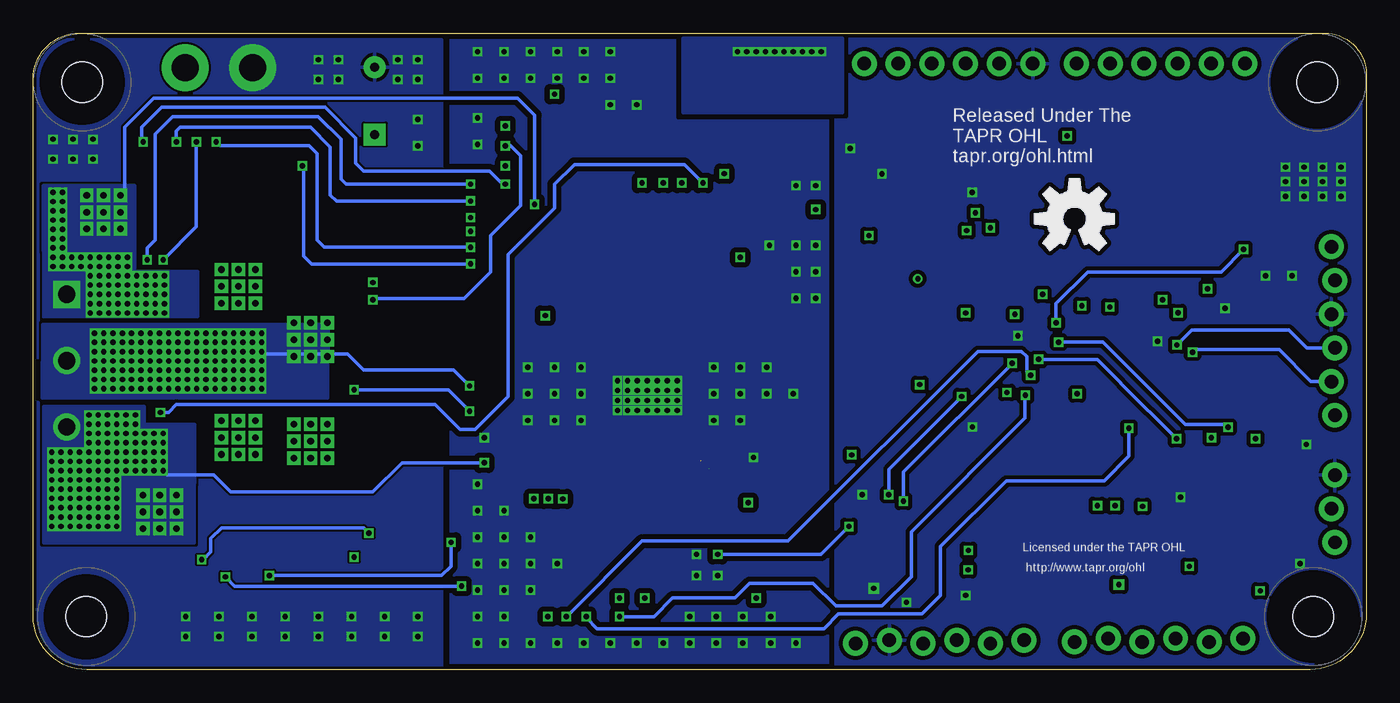
[diagram p9: board, bottom side, seen from below]

Size 100.5 x 48 mm. Coordinates in mm from the lower left corner, seen from the top.
Outline: 0,44.88 0,4.24 arc90 4.24,0 96.47,0 arc90 100.5,4.03 100.5,44.53 arc90 97.03,48 3.12,48 arc90 0,44.88
Copper layers (1*16): Top 0.035mm / dielectric 1.5mm / Bottom 0.035mm
Design rules "default": minimum track width 6mil, minimum drill 12mil, track to track 6mil, track to pad 6mil, pad to pad 6mil, via to via 6mil, smd to smd 0mil, copper to edge 10mil, drill to drill 10mil, minimum pad ring 10mil, minimum via ring 6mil, stop-mask expansion 2mil, vias tented up to drill 100mil, thermal gap 10mil

### Footprints (pad centres in the part's own frame; a part is rotated, then mirrored left to right if it is on the bottom)
0805 = smd 0.8 x 1.2: 1 -0.9,0; 2 0.9,0
1206 = smd 1.6 x 1.8: 1 -1.4,0; 2 1.4,0
CPOL-RADIAL-1000UF-25V = drill 0.7 pad 1.651 square: 1 2.54,0 | drill 0.7 pad 1.651: 2 -2.54,0
SMA-DIODE = smd 1.27 x 1.47: A -2.15,0; C 2.15,0
STAND-OFF-TIGHT = hole 3.048: 0,0
1X02_XTRA_BIG = drill 2.057 pad 3.556: 1 -2.54,0; 2 2.54,0
1X06 = drill 1.016 pad 1.88: 1 -6.35,0; 2 -3.81,0; 3 -1.27,0; 4 1.27,0; 5 3.81,0; 6 6.35,0
1X06_LOCK = drill 1.016 pad 1.88: 1 0,0.127; 2 2.54,-0.127; 3 5.08,0.127; 4 7.62,-0.127; 5 10.16,0.127; 6 12.7,-0.127
1X03_LOCK = drill 1.016 pad 1.88: 1 0,0.127; 2 2.54,-0.127; 3 5.08,0.127
SCREWTERMINAL-5MM-3 = drill 1.3 pad 2.032 square: 1 0,0 | drill 1.3 pad 2.032: 2 5,0; 3 10,0
1X06-SIP_LOCK = drill 1.016 pad 1.88: 1 0,0; 2 2.54,-0.254; 3 5.08,0; 4 7.62,-0.254; 5 10.16,0; 6 12.7,-0.254
MSS6132 = smd 0.25 x 0.25: P$1 2.69,0.02; P$2 -2.73,-0.02
LED-0805 = smd 0.8 x 1.2: 1 -0.9,0; 2 0.9,0
SMT-REF = smd 3.505 x 5.08: 1 2.134,0; 2 -2.007,0
EXB-38V271JV = smd 0.5 x 1: P$1 0,0; P$2 0.8,0; P$3 1.6,0; P$4 2.4,0; P$5 2.4,1.4; P$6 1.6,1.4; P$7 0.8,1.4; P$8 0,1.4
SJ = smd 1.168 x 1.6: 1 -0.762,0; 2 0.762,0
TP06R = smd 0.6 x 0.6: TP 0,0
DGK8 = smd 1.422 x 0.432: 1 -2.184,0.965; 2 -2.184,0.33; 3 -2.184,-0.33; 4 -2.184,-0.965; 5 2.184,-0.965; 6 2.184,-0.33; 7 2.184,0.33; 8 2.184,0.965
D8 = smd 1.981 x 0.559: 1 -2.464,1.905; 2 -2.464,0.635; 3 -2.464,-0.635; 4 -2.464,-1.905; 5 2.464,-1.905; 6 2.464,-0.635; 7 2.464,0.635; 8 2.464,1.905
PW16 = smd 1.676 x 0.356: 1 -2.819,2.286; 2 -2.819,1.626; 3 -2.819,0.965; 4 -2.819,0.33; 5 -2.819,-0.33; 6 -2.819,-0.965; 7 -2.819,-1.626; 8 -2.819,-2.286; 9 2.819,-2.286; 10 2.819,-1.626; 11 2.819,-0.965; 12 2.819,-0.33; 13 2.819,0.33; 14 2.819,0.965; 15 2.819,1.626; 16 2.819,2.286
0603 = smd 1.1 x 1: 1 -0.85,0; 2 0.85,0
QFP64-10X10MC = smd 1.473 x 0.279: 1 -5.613,3.759; 2 -5.613,3.251; 3 -5.613,2.743; 4 -5.613,2.261; 5 -5.613,1.753; 6 -5.613,1.245; 7 -5.613,0.762; 8 -5.613,0.254; 9 -5.613,-0.254; 10 -5.613,-0.762; 11 -5.613,-1.245; 12 -5.613,-1.753; 13 -5.613,-2.261; 14 -5.613,-2.743; 15 -5.613,-3.251; 16 -5.613,-3.759; 33 5.613,-3.759; 34 5.613,-3.251; 35 5.613,-2.743; 36 5.613,-2.261; 37 5.613,-1.753; 38 5.613,-1.245; 39 5.613,-0.762; 40 5.613,-0.254; 41 5.613,0.254; 42 5.613,0.762; 43 5.613,1.245; 44 5.613,1.753; 45 5.613,2.261; 46 5.613,2.743; 47 5.613,3.251; 48 5.613,3.759 | smd 0.279 x 1.473: 17 -3.759,-5.613; 18 -3.251,-5.613; 19 -2.743,-5.613; 20 -2.261,-5.613; 21 -1.753,-5.613; 22 -1.245,-5.613; 23 -0.762,-5.613; 24 -0.254,-5.613; 25 0.254,-5.613; 26 0.762,-5.613; 27 1.245,-5.613; 28 1.753,-5.613; 29 2.261,-5.613; 30 2.743,-5.613; 31 3.251,-5.613; 32 3.759,-5.613; 49 3.759,5.613; 50 3.251,5.613; 51 2.743,5.613; 52 2.261,5.613; 53 1.753,5.613; 54 1.245,5.613; 55 0.762,5.613; 56 0.254,5.613; 57 -0.254,5.613; 58 -0.762,5.613; 59 -1.245,5.613; 60 -1.753,5.613; 61 -2.261,5.613; 62 -2.743,5.613; 63 -3.251,5.613; 64 -3.759,5.613
DCA56_6P35X3P61 = smd 1.27 x 0.305: 1 -3.81,6.756; 2 -3.81,6.248; 3 -3.81,5.74; 4 -3.81,5.258; 5 -3.81,4.75; 6 -3.81,4.242; 7 -3.81,3.759; 8 -3.81,3.251; 9 -3.81,2.743; 10 -3.81,2.261; 11 -3.81,1.753; 12 -3.81,1.245; 13 -3.81,0.762; 14 -3.81,0.254; 15 -3.81,-0.254; 16 -3.81,-0.762; 17 -3.81,-1.245; 18 -3.81,-1.753; 19 -3.81,-2.261; 20 -3.81,-2.743; 21 -3.81,-3.251; 22 -3.81,-3.759; 23 -3.81,-4.242; 24 -3.81,-4.75; 25 -3.81,-5.258; 26 -3.81,-5.74; 27 -3.81,-6.248; 28 -3.81,-6.756; 29 3.81,-6.756; 30 3.81,-6.248; 31 3.81,-5.74; 32 3.81,-5.258; 33 3.81,-4.75; 34 3.81,-4.242; 35 3.81,-3.759; 36 3.81,-3.251; 37 3.81,-2.743; 38 3.81,-2.261; 39 3.81,-1.753; 40 3.81,-1.245; 41 3.81,-0.762; 42 3.81,-0.254; 43 3.81,0.254; 44 3.81,0.762; 45 3.81,1.245; 46 3.81,1.753; 47 3.81,2.261; 48 3.81,2.743; 49 3.81,3.251; 50 3.81,3.759; 51 3.81,4.242; 52 3.81,4.75; 53 3.81,5.258; 54 3.81,5.74; 55 3.81,6.248; 56 3.81,6.756 | smd 3.607 x 6.35: 57 0,0
TO127P600X120-5N = smd 1.65 x 0.6: 1 -2.65,1.905; 2 -2.65,0.635; 3 -2.65,-0.635; 4 -2.65,-1.905 | smd 4.6 x 4.5: 5 1.15,0 | drill 0.5 square: P$1 0,1.27; P$2 1.27,1.27; P$3 2.54,1.27; P$4 2.54,0; P$5 1.27,0; P$6 0,0; P$7 0,-1.27; P$8 1.27,-1.27; P$9 2.54,-1.27

### Placement (x,y rotation side)
C1  47.56,26.88 180 top
C2  46.69,28.88 180 top
C3  63.64,24.62 0 top
C4  64.54,26.58 0 top
C5  45.07,24.6 180 top
C6  45.86,37.68 0 top
C7  11.88,32.6 270 top
C8  51.63,44.97 0 top
C9  51.45,33.8 0 top
C10  55.86,33.8 0 top
C11  60.22,33.83 0 top
C12  81.81,8.5 180 top
C13  85.82,38 180 top
C14  42.47,17.99 270 top
C15  44.58,14.95 270 top
C16  52.75,9.76 270 top
C17  54.58,10.64 270 top
C18  60.13,10.77 90 top
C19  62.96,15.95 180 top
C20  26.86,16.01 0 top
C21  34.2,17.74 180 top
C22  6.97,26.84 0 top
C23  22.74,37 180 top
C24  31.45,35.29 90 top
C25  32.74,26.77 270 top
C26  7.54,16.04 180 top
C27  74.75,42.89 270 top
C28  75.17,34.08 180 top
C29  17,7 270 top
C30  16.48,9.68 180 top
C31  8,8 90 top
D1  51.47,39.95 180 top
E$1  [STAND-OFF-TIGHT]  3.7,44.3 0 top
E$2  [STAND-OFF-TIGHT]  4,4 0 top
E$3  [STAND-OFF-TIGHT]  96.5,4 0 top
E$4  [STAND-OFF-TIGHT]  96.8,44.3 0 top
J2  86.5,45.4 0 top
JP1  15.5,45.7 180 top
JP2  31.49,45.7 180 top
JP3  2.5,31.89 270 top
JP5  38.5,2.1 180 top
JP6  2.5,9.6 90 top
JP7  97.97,28.3 270 top
JP8  22,2.1 180 top
L1  44.11,42.08 270 top
LED1  6.95,23.8 180 top
LED2  6.95,22.17 180 top
LED3  6.95,20.67 180 top
LED4  6.95,19.17 180 top
R4  86.16,34.47 180 top
R5  7.5,32.6 90 top
R6  14.1,32.6 90 top
R7  81.96,12.07 180 top
R8  44.58,17.99 90 top
R9  42.48,14.95 270 top
R10  44.57,11.94 270 top
R11  42.48,11.94 270 top
R17  7.45,13.63 0 top
R18  34.49,32.83 180 top
R19  35.63,35.32 90 top
R20  75.16,35.88 180 top
RN1  10.95,20.2 90 top
SJ1  36.5,20.02 180 top
SJ2  42.24,23.82 270 top
SJ4  36.5,22.28 180 top
SJ5  36.5,24.58 180 top
SJ6  36.5,26.88 180 top
SJ7  36.5,29.2 180 top
SJ8  7.31,11.42 0 top
TP1  34.83,9.87 0 top
TP2  35.92,8.97 0 top
TP3  36.92,8.1 0 top
TP4  38,7.25 0 top
TP5  48.08,13.97 0 top
TP6  49.55,15.13 0 top
TP7  50.17,15.78 0 top
U1  13,7 0 top
U2  12.33,12.94 270 top
U3  24.33,8.65 180 top
U9  40.23,4.93 0 top
U10  69.42,23.77 0 top
U11  79.4,31.1 0 top
U12  85.1,8.5 0 top
U13  78.7,8.5 0 top
U14  82.7,38 0 top
U15  88.9,38 0 top
U$1  22.98,24.6 180 top
U$2  54.2,20.8 90 top
U$3  86.3,17.5 180 top
U$4  79.58,18.5 270 top
U$5  86.3,28.9 180 top
U$6  89.69,11.9 0 top
U$7  79.58,26.16 270 top
U$8  93.92,34.5 0 top

### Tracks (layer width: path | path; a pad name or v marks a point on that pad's centre or on a via)
*SCS
  Top 0.254: U$2.8 50.92,16.04 50.92,15.45 45.05,9.88 TP1.TP arc90 TP1.TP | U$1.52 20.72,16.88 23.8,13.8 30.06,13.8 33.99,9.87 TP1.TP | TP1.TP
AN4  (via drill 0.4 pad 0.25)
  Top 0.254: U$1.17 26.74,31.47 27.44,32.17 29.18,32.17 v30.12,33.11
  Route2 0.254: JP5.4 32.5,3.85 32.5,30.73 v30.12,33.11
AN5  (via drill 0.4 pad 0.25)
  Top 0.254: v28.34,33.33 27.75,33.33 26.24,31.82 26.24,30.22 U$1.18
  Route2 0.254: JP5.5 31.5,5.13 31.5,30.17 v28.34,33.33
CAN_H
  Top 0.254: U2.7 12.96,12.95 12.43,13.48 8.5,13.48 R17.2 8.35,14.58 8.17,14.76 5.57,14.76 5,14.19 5,13 4.14,12.14 JP6.2
CAN_L
  Top 0.254: U2.6 11.7,11.74 11.25,12.19 8.84,12.19 SJ8.2 | 8,11.35 SJ8.2 | JP6.1 5.6,9.6 6,10 7.68,10 8.08,10.4 SJ8.2
CANRX  (via drill 0.4, 0.4 pad 0.25)
  Top 0.254: U$1.58 23.74,20.98 23.74,24.16 v23.2,24.7 | v10.43,18.28 U2.4
  Bottom 0.254: v10.43,18.28 10.65,18.5 13.65,18.5 19.85,24.7 v23.2,24.7
CANTX  (via drill 0.4, 0.4 pad 0.25)
  Top 0.254: U$1.59 24.23,22.93 v24.7,23.4 | U2.1 14.3,15.47 v14.3,17.41
  Bottom 0.254: v14.3,17.41 18.49,21.6 18.5,21.6 18.5,21.61 20.29,23.4 v24.7,23.4
CRNT1  (via drill 0.4)
  Top 0.254: U$2.25 59.46,15.09 60.81,13.74 61.39,13.74 61.64,13.49 61.64,12.96 v61.66,12.89 | U$1.13 26.56,26.86 v26.5,26.8
  Route2 0.254: v61.66,12.89 61.66,13.44 61.4,13.7 45.8,13.7 34.5,25 34.5,28.2 35.1,28.8 35.1,30.1 31.2,34 31.2,36.6 30.6,37.2 27.6,37.2 26.5,36.1 v26.5,26.8
CRNT2  (via drill 0.4)
  Top 0.254: U$2.26 59.94,15.32 61.05,14.21 62.08,14.21 62.75,13.54 v62.75,12.9 | U$1.14 27.66,27.34 26.7,28.3 v24.4,28.3
  Route2 0.254: v24.4,28.3 24.4,35.3 27.1,38 31.5,38 32.6,36.9 32.6,34.1 36.3,30.4 36.3,25.2 44.5,17 60.5,17 62.75,14.75 v62.75,12.9
DC_CAL  (via drill 0.4)
  Top 0.254: U$2.12 52.95,14.05 48.9,10 v48.9,8.7 | U$1.53 21.23,17.37 24.1,14.5 30.5,14.5 34,11 38.75,11 39,10.75 v39,10.8
  Bottom 0.254: v39,10.8 41.1,8.7 v48.9,8.7
DRV_GND  (via drill 0.4)
  Top 0.254: R8.2 C14.1 | U$2.7 50.44,18.6 50.5,18.6 50.5,19.63
  Top 0.406: U$2.28 60.96,18.8 v61.2,18.8
  other vias: 43.2,20.8 45.2,20.8 45.2,22.8 47.2,20.8 47.2,22.8 49.2,20.8 49.2,22.8 49.2,18.8 47.2,18.8 59.2,18.8 59.2,20.8 59.2,22.8 61.2,22.8 61.2,20.8 63.2,20.8 63.2,22.8 63.2,18.8 61,46.6 63,46.6 65,46.6 67,46.6 59,46.6 57,46.6 63,2 61,2 59,2 57,2 55,2 53,2 51,2 49,2 47,2 50.5,8.7 50.5,7.1 48.9,7.1 49,4 51,4 47,4 44.9,4 44.9,2 43,2 46.2,16 65,2 67,2 67,4 67,6 67,8 67,10 67,12 67,14 66.5,17.5 41.5,30 41.5,32 41.5,36.5 41.5,28 43,36.5 43,32 43,30 43,28 45,32 57,44.6 59,44.6 61,44.6 63,44.6 65,44.6 67,44.6 57,42.6 55,42.6 67,41.6 67,39.6 65,12 65,10 65,8 65,6 65,4 63,6 63,8 63,10 61,8 51.95,21.8 52.7,21.8 53.45,21.8 54.2,21.8 54.95,21.8 55.7,21.8 56.45,21.8 56.45,21.05 56.45,20.3 56.45,19.55 55.7,19.55 54.95,19.55 54.2,19.55 53.45,19.55 52.7,19.55 51.95,19.55 51.95,20.3 51.95,21.05 52.7,21.05 53.45,21.05 54.2,21.05 54.95,21.05 55.7,21.05 55.7,20.3 54.95,20.3 54.2,20.3 53.45,20.3 52.7,20.3
  pour Top (isolate 0.406, rank 4, no thermals): 40,0 69,0 69,47.6 40,47.6
  pour Bottom (isolate 0.406, rank 4): 40,0 69,0 69,47.6 40,47.6
  pour Route2 (isolate 0.406, rank 4): 40,0 69,0 69,47.6 40,47.6
EN_A  (via drill 0.4)
  Top 0.254: U3.15 19.73,7.02 18.56,8.19 18.56,10.62 v16.87,12.31 | v14.19,26.92 14.19,26.9 14.23,26.86 U$1.36
  Route15 0.254: v14.19,26.92 14.46,26.65 16.79,26.65 17.37,26.07 17.37,19.87 16,18.5 16,13.18 v16.87,12.31
EN_A+  (via drill 0.4)
  Top 0.254: v30.02,7.53 29.5,7.01 27.16,7.01 U3.2
  Route15 0.254: JP8.2 22.11,5 27.49,5 v30.02,7.53
EN_A-
  Top 0.254: U3.1 22.79,2 22,2 JP8.1
EN_B  (via drill 0.4)
  Top 0.254: U3.14 20.02,7.68 19.34,8.36 19.34,11.43 18.95,11.82 v18.95,12.36 | v19.34,27.35 U$1.35
  Route15 0.254: v18.95,12.36 18.95,26.96 v19.34,27.35
EN_B+  (via drill 0.4)
  Top 0.254: v30,9 28.69,7.69 U3.3
  Route15 0.254: JP8.3 16.92,2.42 20.5,6 27,6 v30,9
EN_B-
  Top 0.254: U3.4 25.36,8.32 25.15,8.11 25.15,6.45 22.64,3.94 16.07,3.94 JP8.4
EN_C  (via drill 0.4)
  Top 0.254: U3.11 20.52,9.62 20.29,9.84 20.29,12.38 v20.27,12.38 | U$1.34 15.41,27.85 v15.37,27.89
  Route15 0.254: v20.27,12.38 20.27,27.76 19.8,28.23 15.71,28.23 v15.37,27.89
EN_C+
  Top 0.254: JP8.6 9.3,3.3 11,5 22.12,5 24,6.88 24,8.63 24.97,9.62 U3.6
EN_C-
  Top 0.254: U3.5 25.25,8.98 24.64,8.37 24.64,6.71 22.41,4.48 12.4,4.48 11.84,3.92 JP8.5
EN_GATE  (via drill 0.4)
  Top 0.254: U$2.16 54.96,13.41 56.06,12.31 56.06,9.34 56.05,9.33 56.05,8.36 53.09,5.4 v46,5.4 | U$1.54 21.73,20.73 v21.8,20.8
  Route15 0.254: v21.8,20.8 21.8,14.3 25.8,10.3 31.1,10.3 36.5,4.9 45.5,4.9 v46,5.4
GH_A  (via drill 0.4)
  Top 0.254: U$2.47 51.94,32.39 51.43,32.9 51.43,35.15 v50,36.7 | U$3.4 v90.89,19.41 v90.9,19.4
  Bottom 0.254: v90.9,19.4 90.3,19.4 89.7,20 70.2,20 68.3,18.1 67.2,18.1 64.7,20.6 64.7,31.3 61.2,34.8 61.2,36.6 59.7,38.1 51.4,38.1 v50,36.7
GH_B  (via drill 0.4)
  Top 0.254: U$2.42 54.45,31.33 55.85,32.73 55.85,38.05 v61.2,43.4 | v76.3,21.1 77.62,21.1 U$4.4 77.67,21.12 77.7,21.1
  Route2 0.254: v61.2,43.4 61.2,31.6 66.1,26.7 66.1,21 v67.6,19.5
  Bottom 0.254: v67.6,19.5 69.2,21.1 v76.3,21.1
GH_C  (via drill 0.4)
  Top 0.254: U$2.37 56.94,29.22 60.22,32.5 60.22,35.15 61.68,36.61 v64.9,36.61 | U$5.4 90.61,30.8 v90.7,30.9
  Route15 0.254: v92.2,39.8 90.9,38.5 89,38.5 88.2,39.3 v88.2,39.8
  Bottom 0.254: v64.9,36.61 65.11,36.61 66.1,37.6 75.6,37.6 76.2,38.2 76.2,40.1 78.5,42.4 90.8,42.4 92.3,40.9 92.3,39.9 v92.2,39.8 | v88.2,39.8 88.2,33.4 v90.7,30.9
GL_A  (via drill 0.4)
  Top 0.254: U$2.45 52.95,32.52 53.34,32.91 53.34,34.83 53,35.17 v53,36.7 | U$6.4 87.04,9.06 v87.8,8.3
  Route15 0.254: v75.2,10.3 70.2,10.3 69,11.5 69,16.3 65.6,19.7 65.6,24.7 64.5,25.8 61.3,25.8 53,34.1 v53,36.7
  Bottom 0.254: v87.8,8.3 87.7,8.3 87.1,8.9 87.1,9.9 86.3,10.7 75.6,10.7 v75.2,10.3
GL_B  (via drill 0.4)
  Top 0.254: U$2.40 55.45,30.41 57.68,32.67 57.68,36.58 60.6,39.5 v64.9,39.5 | v74.9,27.9 75.8,27.9 76.7,28.8 U$7.4
  Bottom 0.254: v64.9,39.5 64.5,39.5 63.75,38.75 63.75,35 66,32.75 66,30 68,28 74.8,28 v74.9,27.9
GL_C  (via drill 0.4)
  Top 0.254: U$2.35 57.96,28.39 66.18,36.61 v67.53,36.61 | v91.9,30.9 91.9,31.96 U$8.4
  Bottom 0.254: v67.53,36.61 76.91,36.61 77.3,37 77.3,40 79,41.7 90,41.7 91.3,40.4 91.3,32.4 91.9,31.8 v91.9,30.9
GND  (via drill 0.4, 0.4 pad 0.25, 0.4 pad 0.81)
  Top 0.254: U$1.41 16.43,24.35 | 16.43,24.35 16.42,24.34 | 16.43,24.35 16.24,24.35 v15.73,24.76 | U1.4 10.35,5.57 9.55,5.57 | U1.5 15.15,6 14,6 | U$1.20 25.24,32.34 29.26,36.36 31.28,36.36 C24.2 29.9,36.19 29.76,36.05 | U$1.25 22.73,36.09 C23.1 | C25.2 31.72,24.85 U$1.9 26.56,24.85 26.27,25.14 | U3.12 22.48,8.98 22.5,9 23,9
  other vias: 36.52,37.39 4.52,16.98 5.6,29.7 7.6,29.7 5,8 14,13 10.65,27.26 26.27,25.18 29.72,35.99 29.7,18.3 38,13.2 1.9,37.9 3.3,37.9 4.7,37.9 6.1,37.9 3.3,36.8 1.9,36.8 4.7,36.8 6.1,36.8 1.9,35.7 3.3,35.7 4.7,35.7 6.1,35.7 37.14,6.13 34.67,5.08 30.2,5.6 38.9,39.3
  pour Top (isolate 0.305, rank 2, no thermals): 0,47.6 40,47.6 40,0 0,0
  pour Bottom (isolate 0.305, rank 2): 0,47.6 40,47.6 40,0 0,0
MCLR  (via drill 0.4 pad 0.25)
  Top 0.254: JP3.1 7.31,31.89 R5.1 v9.25,31.7 | U$1.7 25.71,23.84 v23.39,26.16
  Bottom 0.254: v9.25,31.7 10.95,30 21,30 23.39,27.61 v23.39,26.16
MISO
  Top 0.254: U$2.10 51.94,15.53 51.94,14.81 45.23,8.1 TP3.TP 33.3,8.1 28.8,12.6 23.3,12.6 19.73,16.17 U$1.50
MOSI
  Top 0.254: U$2.9 51.47,15.77 51.46,15.76 51.46,15.22 45.19,8.95 36.15,8.95 | U$1.51 20.24,16.46 23.5,13.2 29.35,13.2 33.6,8.95 36.15,8.95 | 36.15,8.95 TP2.TP
N$1
  Top 0.254: U$2.56 C5.1
N$2
  Top 0.254: R5.2 C7.1 R6.2
N$3
  Bottom 0.2: 22.79,32.09 arc9 23.09,32.25 23.85,31.64 24.36,32.15 23.75,32.91 arc19 24.01,33.54 24.98,33.63 24.98,34.37 24.01,34.46 arc19 23.75,35.09 24.36,35.85 23.85,36.36 23.09,35.75 arc19 22.46,36.01 22.37,36.98 21.63,36.98 21.54,36.01 arc19 20.91,35.75 20.15,36.36 19.64,35.85 20.25,35.09 arc19 19.99,34.46 19.02,34.37 19.02,33.63 19.99,33.54 arc19 20.25,32.91 19.64,32.15 20.15,31.64 20.91,32.25 arc9 21.21,32.09 21.64,33.13 arc-68 21.06,34 arc-248 22.36,33.13 22.79,32.09
N$4
  Top 0.254: U$2.52 49.45,30.35 45,34.8 45,37.64 C6.1
N$5
  Top 0.254: U$1.1 28.66,20.84 29.8,19.7 35.42,19.7 SJ1.2
N$6
  Top 0.254: R20.1 C28.1
N$7
  Top 0.254: U$2.4 48.94,15.25 48.08,14.39 TP5.TP
N$8
  Top 0.254: U$2.48 51.46,31.77 50.55,32.68 C9.1 50.55,33.45
N$9
  Top 0.254: U$2.43 53.95,31.75 54.97,32.77 C10.1
N$10
  Top 0.254: U$2.38 56.46,29.52 59.15,32.24 59.15,33.81 C11.1
N$11
  Top 0.254: U$2.55 47.95,25.56 47.72,25.79 43.45,25.79 SJ2.1
N$12  (1 unrouted)
  Top 0.254: U$2.5 49.45,15.3 49.5,15.25 49.5,15.16 TP6.TP
N$13
  Top 0.254: U1.6 16.43,6.67 C29.2
N$14
  Top 0.254: R8.1 44.68,16.99 U$2.1
N$15
  Top 0.254: C15.2 R9.2
N$16
  Top 0.254: U$2.2 47.95,15.78 47.11,14.94 42.78,14.94 42.49,15.21 R9.1 42.2,16.13 42.2,16.8 42.39,16.99 C14.2
N$17
  Top 0.254: U$2.3 48.46,15.56 46.7,13.8 46.3,13.8 45.3,12.8 44.71,12.8 R10.1 42.77,11.14 R11.2
N$18
  Top 0.254: U$2.13 53.44,11.35 C16.1
N$19
  Top 0.254: U$2.14 53.95,12.17 C17.1
N$20
  Top 0.254: U$2.15 54.45,13.18 55.55,12.08 55.55,10.71 C17.2
N$21
  Top 0.254: U$2.23 58.44,14.65 59.61,13.48 59.61,12.19 C18.2
N$22
  Top 0.254: U$2.27 60.45,16.1 60.6,15.95 C19.2
N$23
  Top 0.254: U1.7 16.43,7.33 C29.1
N$24  (1 unrouted)
  Top 0.254: U$2.6 49.96,16.04 50.23,15.77 | 50.19,15.75 50.18,15.75 50.17,15.76 | 50.17,15.76 50.15,15.78 TP7.TP 50.19,15.79 50.19,15.78 TP7.TP | TP7.TP 50.17,15.76 | 50.17,15.76 TP7.TP | TP7.TP 50.23,15.77 | 50.23,15.77 50.25,15.75 50.19,15.75 | 50.19,15.75 TP7.TP | TP7.TP
N$25
  Top 0.254: U$1.15 29.65,27.85 30.26,28.46 30.26,28.47 33.45,31.66 33.45,32.69 R18.2 | 33.36,32.6 R18.2 | R18.2 33.59,33.57 34.32,34.3 35.51,34.3 R19.1
N$27
  Top 0.254: U$1.4 35.68,22.34 SJ4.2
N$28
  Top 0.254: U$1.5 33.27,22.85 34.98,24.56 35.72,24.56 SJ5.2
N$29
  Top 0.254: U$1.6 32.92,23.36 34.51,24.94 34.51,26.36 35.03,26.88 SJ6.2
N$30
  Top 0.254: U$1.8 32.97,24.35 33.86,25.24 33.86,28.16 34.9,29.2 SJ7.2
N$31
  Top 0.254: U$1.56 22.73,17.67 24.3,16.1 25.37,16.1 C20.1
N$33
  Top 0.254: U$1.48 13.23,20.84 12.59,20.2 RN1.P$1
N$41
  Top 0.254: U$1.47 12.84,21.35 12.49,21 RN1.P$2
N$42
  Top 0.254: U$1.46 11.01,21.86 RN1.P$3
N$43
  Top 0.254: U$1.45 12.76,22.34 12.5,22.6 RN1.P$4
N$44
  Top 0.254: LED1.1 8.35,23.8 RN1.P$5
N$45
  Top 0.254: RN1.P$6 8.22,21.8 LED2.1
N$46
  Top 0.254: RN1.P$7 8.18,21 LED3.1
N$47
  Top 0.254: LED4.1 8.52,19.17 RN1.P$8
N$48
  Top 0.254: U$1.32 19.22,31.28 9.1,41.4 9.1,45.65 JP1.6
N$49
  Top 0.254: U$1.31 19.73,31.97 11.7,40 JP1.5
N$50
  Top 0.254: JP1.4 14.3,45.63 14.3,38.8 20.24,32.86 U$1.30
N$51
  Top 0.254: U$1.29 20.72,33.98 16.7,38 16.7,45.63 JP1.3
N$52
  Top 0.254: U$1.28 21.23,34.57 18.5,37.3 18.5,44.89 JP1.2
N$53
  Top 0.254: U$1.27 21.73,35.16 19.8,37.1 19.8,41.5 21.9,43.6 21.9,45.65 JP1.1
N$55
  Top 0.254: U$1.16 28.59,28.99 32.5,32.9 32.5,33.6 33.9,35 33.9,39.1 35.4,40.6 35.4,45.6 JP2.2
N$56
  Top 0.254: U$1.21 24.73,33.03 32.7,41 32.7,45.64 JP2.3
N$57
  Top 0.254: U$1.22 24.23,34.42 30.2,40.4 30.2,45.68 JP2.4
N$58
  Top 0.254: U$1.23 23.74,35.04 27.6,38.9 27.6,45.62 JP2.5
N$64
  Top 0.254: R17.1 SJ8.1
PGC  (via drill 0.4 pad 0.25)
  Top 0.254: U$1.44 14.19,22.85 v13.1,23.94
  Bottom 0.254: JP3.5 4.17,21.73 6.57,24.13 12.91,24.13 v13.1,23.94
PGD  (via drill 0.4 pad 0.25)
  Top 0.254: U$1.43 15.41,23.36 v14.28,24.49
  Bottom 0.254: JP3.4 4.5,24.27 5.83,25.6 13.17,25.6 v14.28,24.49
PGND  (via drill 0.4)
  other vias: 71.5,4 74,4 76.5,4 79,4 81.5,4 84,4 86.5,4 74,2.5 71.5,2.5 76.5,2.5 79,2.5 81.5,2.5 84,2.5 86.5,2.5 89,2.5 89,4 71.5,46 71.5,41.5 71.5,39.5 77.5,46 77.5,44.5 79,44.5 79,46 73,46 73,44.5 71.5,44.5 99,40 97.5,40 96,40 96,38.5 97.5,38.5 99,38.5
  pour Top (rank 4, no thermals): 69.7,47.5 100.5,47.5 100.5,0.1 69.7,0.1
  pour Bottom (rank 4): 69.7,47.5 100.5,47.5 100.5,0.1 69.7,0.1
  pour Route2 (rank 4): 69.7,47.5 100.5,47.5 100.5,0.1 69.7,0.1
PH1
  Top 0.254: U$2.50 U$2.51 50.15,24.8 50.2,24.8 | 46.4,39.6 44.34,39.6 L1.P$1
  Top 0.813: 50.2,24.8 50.2,30.8 46.76,34.24 C6.2 46.76,39.24 | 46.76,39.24 46.4,39.6 | D1.C 47.47,39.95 46.76,39.24
PVDD  (via drill 0.4)
  Top 0.254: U$5.P$5 U$5.5 | U$3.P$5 84.3,17.5 85.3,16.5 85.3,17.35 U$3.5 | U$4.5 U$4.P$5 U$4.P$9 | 48.7,25.25 48.7,24.85 U$2.54 U$2.53 | R20.2 74.75,36.37 C27.1 | JP2.1 37.84,35.28 38.06,35.06 | 38.06,35.06 38.42,34.7 v41.5,34.7 | R18.1 35.83,32.83 38.06,35.06
  Top 0.813: 48.7,25.25 48.7,26.64 C1.1 48.46,28.51 C2.1 48.09,30.21 v47.2,31.1
  Route15 0.254: v41.5,34.7 41.5,33.7
  Route15 0.61: 70.2,7.2 68.1,7.2
  other vias: 61.9,26.7
  pour Top (rank 2, no thermals): 62.2,27.11 61.11,26.28 60.91,26.03 60.9,24.06 60.89,24.05 63.16,24.05 63.26,24.15 63.27,26.96 63.2,27.11
  pour Route15 (rank 4): 69.7,47.5 100.5,47.5 100.5,0.1 69.7,0.1
  pour Route15 (isolate 0.406, rank 4): 40,0 69,0 69,47.6 40,47.6
PWM1H  (via drill 0.4, 0.4 pad 0.25)
  Top 0.254: U$1.2 29.75,21.35 v30.5,20.6 | U$2.17 55.45,13.54 56.54,12.44 56.54,7.54 v54.4,5.4
  Route15 0.254: v54.4,5.4 47.7,5.4 46.6,6.5 38.5,6.5 37.5,7.5 37.5,11.7 v36,13.2
  Bottom 0.254: v30.5,20.6 36,15.1 v36,13.2
PWM1L  (via drill 0.4)
  Top 0.254: U$2.18 55.95,13.68 57.03,12.6 57.03,6.13 v56.3,5.4 | U$1.3 28.58,21.84 27.46,21.84 27.1,22.2 27.1,22.7 v26.7,23.1
  Route2 0.254: v56.3,5.4 56.3,5.5 55.6,6.2 46.8,6.2 46.5,6.5 38.5,6.5 36,9 36,11.6 v34.9,12.7
  Bottom 0.254: v34.9,12.7 34.9,14.9 v26.7,23.1
PWM2H  (via drill 0.4)
  Top 0.254: U$2.19 56.46,13.87 57.51,12.82 57.5,12.81 57.5,4.5 57,4 v56.3,4 | v25.7,20.7 25.7,19.01 U$1.62
  Bottom 0.254: v56.3,4 53.7,4 52.3,5.4 47.6,5.4 46.5,6.5 41.7,6.5 40,4.8 36.5,4.8 34.3,7 34.3,10.41 U$1.62 25.72,20.68 v25.7,20.7 25.7,20.5
PWM2L  (via drill 0.4)
  Top 0.254: U$2.20 56.94,14.05 58,12.99 58,4.3 58.3,4 v58.8,4 | U$1.63 26.23,20.03 v27.1,20.9
  Route2 0.254: v27.1,20.9 26.2,20 26.2,19.1 26,18.9 18.6,18.9 v17.9,18.2
  Bottom 0.254: v58.8,4 58.8,3.9 58,3.1 40.9,3.1 39.8,4.2 33.5,4.2 32.1,5.6 32.1,9.3 27.15,14.25 19.75,14.25 17.9,16.1 v17.9,18.2
PWM3H  (via drill 0.4)
  Top 0.254: U$2.21 57.45,14.17 58.46,13.16 58.46,5.84 v60.3,4 | U$1.60 24.73,21.63 v25.3,22.2
  Bottom 0.254: v60.3,4 54.6,9.7 43.6,9.7 29.3,24 26,24 25.6,23.6 25.6,22.5 v25.3,22.2
PWM3L  (via drill 0.4)
  Top 0.254: U$2.22 57.96,14.34 59.01,13.29 59.01,6.69 v61.7,4 | U$1.61 25.24,17.76 25.5,17.5 30.8,17.5 32.4,15.9 38.5,15.9 v38.8,16.2
  Route2 0.254: v61.7,4 57.3,8.4 55.9,8.4 54.6,9.7 45.6,9.7 39.1,16.2 v38.8,16.2
RA11  (via drill 0.4, 0.4 pad 0.25)
  Top 0.254: v30.2,26.9 29.66,26.36 U$1.12
  Route2 0.254: v33.66,21.5 33.66,2.21 JP5.3
  Route15 0.254: v30.2,26.9 30.2,24.96 v33.66,21.5
SCLK
  Top 0.254: U$2.11 52.45,15.22 52.45,15.21 52.45,14.47 45.48,7.25 TP4.TP 33.1,7.25 28.35,12 23,12 19.22,15.78 U$1.49
SH_A  (via drill 0.4, 0.4 pad 0.25)
  Top 0.254: U$2.46 52.45,33.8 C9.2 52.35,35.95 v51.6,36.7
  Route15 0.254: v66.5,15.6 64.7,17.4 64.7,23.9 63.7,24.9 58.9,24.9 51.6,32.2 v51.6,36.7
  Bottom 0.254: v90.7,15.01 90.39,14.7 86.9,14.7 85.6,13.4 74.9,13.4 72.7,15.6 v66.5,15.6
  other vias: 90.7,17.81 90.7,15.71 90.7,17.11 90.7,16.41 91.4,17.81 91.4,17.11 91.4,16.41 91.4,15.71 91.4,15.01 92.1,15.01 92.1,15.71 92.1,16.41 92.1,17.11 92.1,17.81 97,16.41 97.7,16.41 98.4,16.41 99.1,16.41 99.1,15.71 98.4,15.71 97.7,15.71 97,15.71 97,15.01 97.7,15.01 98.4,15.01 99.1,15.01 99.1,14.31 98.4,14.31 98.4,13.61 99.1,13.61 98.4,12.91 99.1,12.91 98.4,12.21 99.1,12.21 98.4,11.51 99.1,11.51 98.4,10.81 99.1,10.81 92.8,18.51 92.8,19.21 93.5,19.21 93.5,18.51 94.2,19.21 94.2,18.51 94.9,19.21 94.9,18.51 95.6,18.51 95.6,19.21 92.8,17.81 92.8,15.01 92.8,15.71 92.8,17.11 92.8,16.41 93.5,17.81 93.5,17.11 93.5,16.41 93.5,15.71 93.5,15.01 94.2,15.01 94.2,15.71 94.2,16.41 94.2,17.11 94.2,17.81 94.9,17.81 94.9,15.01 94.9,15.71 94.9,17.11 94.9,16.41 95.6,17.81 95.6,17.11 95.6,16.41 95.6,15.71 95.6,15.01 96.3,15.01 96.3,15.71 96.3,16.41 96.3,17.11 96.3,17.81 94.2,14.31 94.2,11.51 94.2,12.21 94.2,13.61 94.2,12.91 94.9,14.31 94.9,13.61 94.9,12.91 94.9,12.21 94.9,11.51 95.6,11.51 95.6,12.21 95.6,12.91 95.6,13.61 95.6,14.31 94.2,10.81 94.9,10.81 95.6,10.81 96.3,14.31 96.3,11.51 96.3,12.21 96.3,13.61 96.3,12.91 97,14.31 97,13.61 97,12.91 97,12.21 97,11.51 97.7,11.51 97.7,12.21 97.7,12.91 97.7,13.61 97.7,14.31 96.3,10.81 97,10.81 97.7,10.81 96.3,18.51 96.3,19.21
  pour Route2 (isolate 0.254): 88.33,18.49 92.12,18.5 92.12,19.84 99.67,19.84 99.69,9.56 88.35,9.55
  pour Bottom (isolate 0.254): 88.34,18.49 92.12,18.5 92.14,19.84 99.69,19.84 99.69,9.56 88.36,9.55
  pour Top (isolate 0.254): 88.32,18.49 92.12,18.5 92.13,19.84 99.68,19.84 99.7,9.56 88.35,9.55
  pour Route15 (isolate 0.254): 88.34,18.48 92.12,18.5 92.12,19.84 99.67,19.84 99.68,9.55 88.35,9.53
SH_B  (via drill 0.4, 0.4 pad 0.25)
  Top 0.254: U$2.41 54.96,30.83 56.76,32.63 C10.2 56.76,37.26 60.5,41 v64.9,41
  Route2 0.254: v64.9,41 64.4,41 63.8,40.4 63.8,36.1 64.4,35.5 64.4,29.5 66,27.9 68,27.9 68.2,27.7 68.2,22 v67.6,21.4
  Bottom 0.254: v67.6,21.4 68.8,22.6 75.6,22.6 76.8,23.8 83.1,23.8 v83.28,23.98
  other vias: 83.98,24.68 84.68,24.68 85.38,24.68 83.28,23.28 84.68,23.98 83.98,23.98 85.38,23.98 83.28,25.38 84.68,23.28 85.38,23.28 83.98,23.28 83.28,21.18 83.28,24.68 83.28,21.88 83.28,22.58 83.98,25.38 84.68,25.38 85.38,25.38 85.38,22.58 84.68,22.58 83.98,22.58 83.98,21.88 84.68,21.88 85.38,21.88 85.38,21.18 84.68,21.18 83.98,21.18 89.58,24.68 90.28,24.68 90.98,24.68 88.88,23.28 90.28,23.98 89.58,23.98 90.98,23.98 88.88,25.38 90.28,23.28 90.98,23.28 89.58,23.28 88.88,21.18 88.88,24.68 88.88,23.98 88.88,21.88 88.88,22.58 89.58,25.38 90.28,25.38 90.98,25.38 90.98,22.58 90.28,22.58 89.58,22.58 89.58,21.88 90.28,21.88 90.98,21.88 90.98,21.18 90.28,21.18 89.58,21.18 86.78,24.68 87.48,24.68 88.18,24.68 86.08,23.28 87.48,23.98 86.78,23.98 88.18,23.98 86.08,25.38 87.48,23.28 88.18,23.28 86.78,23.28 86.08,21.18 86.08,24.68 86.08,23.98 86.08,21.88 86.08,22.58 86.78,25.38 87.48,25.38 88.18,25.38 88.18,22.58 87.48,22.58 86.78,22.58 86.78,21.88 87.48,21.88 88.18,21.88 88.18,21.18 87.48,21.18 86.78,21.18 92.38,24.68 93.08,24.68 93.78,24.68 91.68,23.28 93.08,23.98 92.38,23.98 93.78,23.98 91.68,25.38 93.08,23.28 93.78,23.28 92.38,23.28 91.68,21.18 91.68,24.68 91.68,23.98 91.68,21.88 91.68,22.58 92.38,25.38 93.08,25.38 93.78,25.38 93.78,22.58 93.08,22.58 92.38,22.58 92.38,21.88 93.08,21.88 93.78,21.88 93.78,21.18 93.08,21.18 92.38,21.18 95.18,24.68 95.88,24.68 94.48,23.28 95.88,23.98 95.18,23.98 94.48,25.38 95.88,23.28 95.18,23.28 94.48,21.18 94.48,24.68 94.48,23.98 94.48,21.88 94.48,22.58 95.18,25.38 95.88,25.38 95.88,22.58 95.18,22.58 95.18,21.88 95.88,21.88 95.88,21.18 95.18,21.18
  pour Top (isolate 0.254): 78.27,26.03 99.77,26.03 99.8,20.5 78.3,20.5
  pour Bottom (isolate 0.254): 78.27,26.03 99.77,26.03 99.8,20.5 78.3,20.5
  pour Route2 (isolate 0.254): 78.27,26.03 99.77,26.03 99.8,20.5 78.3,20.5
  pour Route15 (isolate 0.254): 78.27,26.03 99.77,26.03 99.8,20.5 78.3,20.5
SH_C  (via drill 0.4)
  Top 0.254: U$2.36 57.45,28.83 60.96,32.29 60.94,32.28 61.12,32.46 C11.2 | C11.2 | C11.2 62.4,35.1 v62.7,35.1
  Bottom 0.254: v62.7,35.1 62.7,41.8 64,43.1 91.4,43.1 93.6,40.9 93.6,36.1 93.9,35.8
  other vias: 90.6,26.9 90.6,27.6 90.6,28.3 90.6,29 90.6,29.7 91.3,29.7 91.3,29 91.3,28.3 91.3,27.6 91.3,26.9 92,29.7 92,29 92,28.3 92,27.6 92,26.9 92.7,27.6 92.7,28.3 92.7,29 92.7,29.7 92.7,26.9 93.4,26.9 94.1,26.9 94.8,26.9 95.5,26.9 96.2,26.9 96.2,27.6 95.5,27.6 94.8,27.6 94.1,27.6 93.4,27.6 93.4,28.3 93.4,29 93.4,29.7 94.1,29.7 94.1,29 94.1,28.3 94.8,28.3 95.5,28.3 96.2,28.3 94.8,29 95.5,29 96.2,29 94.8,29.7 95.5,29.7 96.2,29.7 93.4,30.4 93.4,31.1 94.1,31.1 94.1,30.4 94.8,30.4 94.8,31.1 95.5,31.1 95.5,30.4 96.2,31.1 96.2,30.4 96.9,30.4 97.6,30.4 98.3,30.4 99,30.4 96.9,31.1 97.6,31.1 98.3,31.1 99,31.1 98.3,31.8 99,31.8 98.3,32.5 99,32.5 98.3,33.2 98.3,33.9 98.3,34.6 98.3,35.3 98.3,36 99,36 99,35.3 99,34.6 99,33.9 99,33.2
  pour Top (isolate 0.254): 88.09,30.01 92.86,30.01 92.85,36.49 99.75,36.51 99.72,26.6 88.09,26.61
  pour Bottom (isolate 0.254): 88.09,30.01 92.86,30.01 92.85,36.49 99.75,36.51 99.72,26.61 88.09,26.62
  pour Route2 (isolate 0.254): 88.09,30.01 92.86,30.01 92.85,36.49 99.75,36.51 99.72,26.61 88.09,26.62
  pour Route15 (isolate 0.254): 88.09,30.01 92.86,30.01 92.85,36.49 99.75,36.51 99.72,26.61 88.08,26.61
SL_A  (via drill 0.4)
  Top 0.254: U$2.44 53.44,32.22 53.95,32.73 53.95,36.05 v54.6,36.7 | v86,7 86,8.45 U12.2
  Route2 0.254: v54.6,36.7 59,36.7 59.6,36.1 59.6,31.2 64.7,26.1 64.7,20.6 68.3,17 68.3,6.4 v68.2,6.3
  Bottom 0.254: v68.2,6.3 85.3,6.3 v86,7
SL_B  (via drill 0.4)
  Top 0.254: U$2.39 55.95,29.94 58.34,32.33 58.34,35.31 61.03,38 v64.9,38 | v74.9,29.2 74.9,29.5 76.5,31.1 U11.1
  Route2 0.254: v64.9,38 74.2,38 74.9,37.3 v74.9,29.2
SL_C  (via drill 0.4)
  Top 0.254: U$2.34 58.44,28.09 62.72,32.37 62.73,32.37 65.7,35.34 v67.53,35.34 | v89.7,39.8 89.7,38.05 U15.2
  Bottom 0.254: v67.53,35.34 77.64,35.34 78.1,35.8 78.1,39.4 79.6,40.9 89.4,40.9 89.7,40.6 v89.7,39.8
SN1  (via drill 0.4)
  Top 0.254: U$2.33 58.95,27.79 65.25,34.09 v67.53,34.09 | v82.7,7.1 C12.1 U12.1 84.25,11.35 84.2,11.4 84.2,11.84 R7.2
  Route2 0.254: v67.53,34.09 66.89,34.09 65.7,32.9 65.7,29.5 66.6,28.6 68.79,28.6 69,28.39 v69,9.6
  Bottom 0.254: v82.7,7.1 69.7,7.1 69,7.8 v69,9.6
  pour Top (isolate 0.254): 87.69,14.51 82.35,14.5 82.34,11.06 87.67,11.09
SN2  (via drill 0.4)
  Top 0.254: U$2.31 59.94,26.96 64.83,31.85 v67.53,31.85 | R4.2 88.05,34.59 U15.1 C13.1 86.7,38.02 v86.7,39.8
  Bottom 0.254: v67.53,31.85 78.55,31.85 79.1,32.4 79.1,38.9 79.7,39.5 86.4,39.5 v86.7,39.8
  pour Top (isolate 0.254): 92.2,36.97 86.55,36.96 86.55,33.5 92.2,33.49
SP1  (via drill 0.4)
  Top 0.254: U$2.32 59.46,27.4 63.48,31.41 63.49,31.41 65.13,33.05 v67.53,33.05 | v76.3,8.5 U13.1
  Route2 0.254: v67.53,33.05 66.85,33.05 66.4,32.6 66.4,29.9 66.9,29.4 69.5,29.4 69.7,29.2 69.7,9.3 70.5,8.5 v76.3,8.5
SP2  (via drill 0.4)
  Top 0.254: U$2.30 60.45,26.57 64.46,30.58 67.48,30.58 v67.53,30.6 | v80.2,38 U14.1
  Bottom 0.254: v67.53,30.6 79.5,30.6 80.1,31.2 80.1,37.9 v80.2,38
VCC3V3  (via drill 0.4, 0.4 pad 0.25, 0.4 pad 0.81)
  Top 0.254: 14.13,31.73 R6.1 14,31.6 14,31 11.98,28.98 v11.98,28.73 8.73,28.73 8,28 8,26.97 C22.2 8.87,25.84 U$1.38 | SJ7.1 SJ6.1 SJ5.1 SJ4.1 SJ1.1 37.3,19.98 37.3,18.7 36.34,17.74 C21.1 | SJ7.1 38.06,30 38.06,31.6 37.5,32.16 v37.5,32.74 | C26.1 8.44,17.34 v8.36,17.42 | U1.3 U1.2 10.59,7.1 C31.1 v8,5.95 | U$1.19 25.72,32.08 28.03,34.39 29.4,34.39 | U$1.10 30.47,25.36 31.86,26.75 31.86,26.79 C25.1 32.74,28.4 v33.81,29.47 34.98,30.64 37.06,30.64 37.26,30.44 SJ7.1 | U$1.26 22.22,36.62 C23.2 21.84,39.54 v22.55,40.25 | 29.4,34.39 C24.1 | 29.4,34.39 v29.47,34.46 | U$2.49 50.95,31.36 49.2,33.14 48.4,33.94 v48.4,37.4 | 44.2,10.8 44.54,11.14 R10.2 45.04,11.04 v46.6,12.6 | U$2.24 58.95,14.88 60.57,13.26 v60.57,12.88 | U$1.57 23.23,21.17 21.45,22.95 v21.45,27.45 | U3.13 21.52,8.33 22.61,8.33 23,7.94 23,7 22.36,6.36 U3.16 18.72,6.36 v18.66,6.42
  Top 0.305: U2.3 11.7,17.48 v11.68,17.5
  Route2 0.254: v48.4,37.4 48.4,42.8 | v60.57,12.88 57.99,10.4 46.3,10.4 45.45,11.25 | 45.45,11.25 39.5,17.2 39.5,18.2 | v46.6,12.6 46.6,12.4 45.45,11.25 | v18.66,6.42 18.58,6.42 18.5,6.5
  Bottom 0.254: v8.36,17.42 8.31,17.42 8.22,17.51 | v8,5.95 8.19,5.95 | v21.45,27.45 21.45,27.23 | v33.81,29.47 33.87,29.47 33.98,29.58
  Bottom 0.305: v11.68,17.5 11.68,17.68
  other vias: 41.1,46.6 41.8,46.6 42.5,46.6 43.2,46.6 43.9,46.6 44.6,46.6 45.3,46.6 46,46.6 46.7,46.6 47.4,46.6
  pour Top (no thermals): 39.5,47.61 51.5,47.61 51.5,42 39.5,42
  pour Route2 (isolate 0.305, rank 2): 0,47.6 40,47.6 40,0 0,0
  pour Route15 (isolate 0.305, rank 2): 0,47.6 40,47.6 40,0 0,0
  pour Route2 (no thermals): 39.5,47.61 51.5,47.61 51.5,42 39.5,42
  pour Bottom (no thermals): 39.5,47.61 51.5,47.61 51.5,42 39.5,42
  pour Route15 (no thermals): 39.5,47.61 51.5,47.61 51.5,42 39.5,42
VCC5V  (via drill 0.4)
  Top 0.254: C30.2 15.18,9.28 U1.8 15.15,8 14,8 13.79,7.79 v13.34,7.79
  Route2 0.254: JP5.6 25.06,2.23 22.86,4.43 14.2,4.43 13.36,5.27 13.36,7.77 v13.34,7.79

### Text on the board
tNames: V_IN | PVDD | GND | PMSM Driver v1.6 / 6-40 V 40 Amps / http://pavlo.me / (C) - 2013 Pavlo Manovi | ICSP | MCLR | GND | *FAULT | *OCTW | PWRGD | Ferrite beads on / SH_x / SL_x are / optional. | CAN_H | CS | CAN_L | MISO | MOSI | SCLK | GND | C+ | C- | B- | B+ | A+ | A- | 5v | Motor: / W V U | 3.3v | NO SENSITIVE COMPONENTS ABOVE
bNames: Released Under The / TAPR OHL / tapr.org/ohl.html | Licensed under the TAPR OHL | http://www.tapr.org/ohl